# EasyEDA Pro project PRJ_Mainboard V0.1b.epro, schematic Mainboard

## Sheets
1 MCU: Board Name: Mainboard; Create Date: 2025-02-10; Page Name: MCU; Project Name: OrionPnP-Core; Schematic Name: Mainboard; Update Date: 2025-02-10; Company: EasyEDA.com; Drawn: Giovanni C.; Page Size: A3; Version: V0.1b
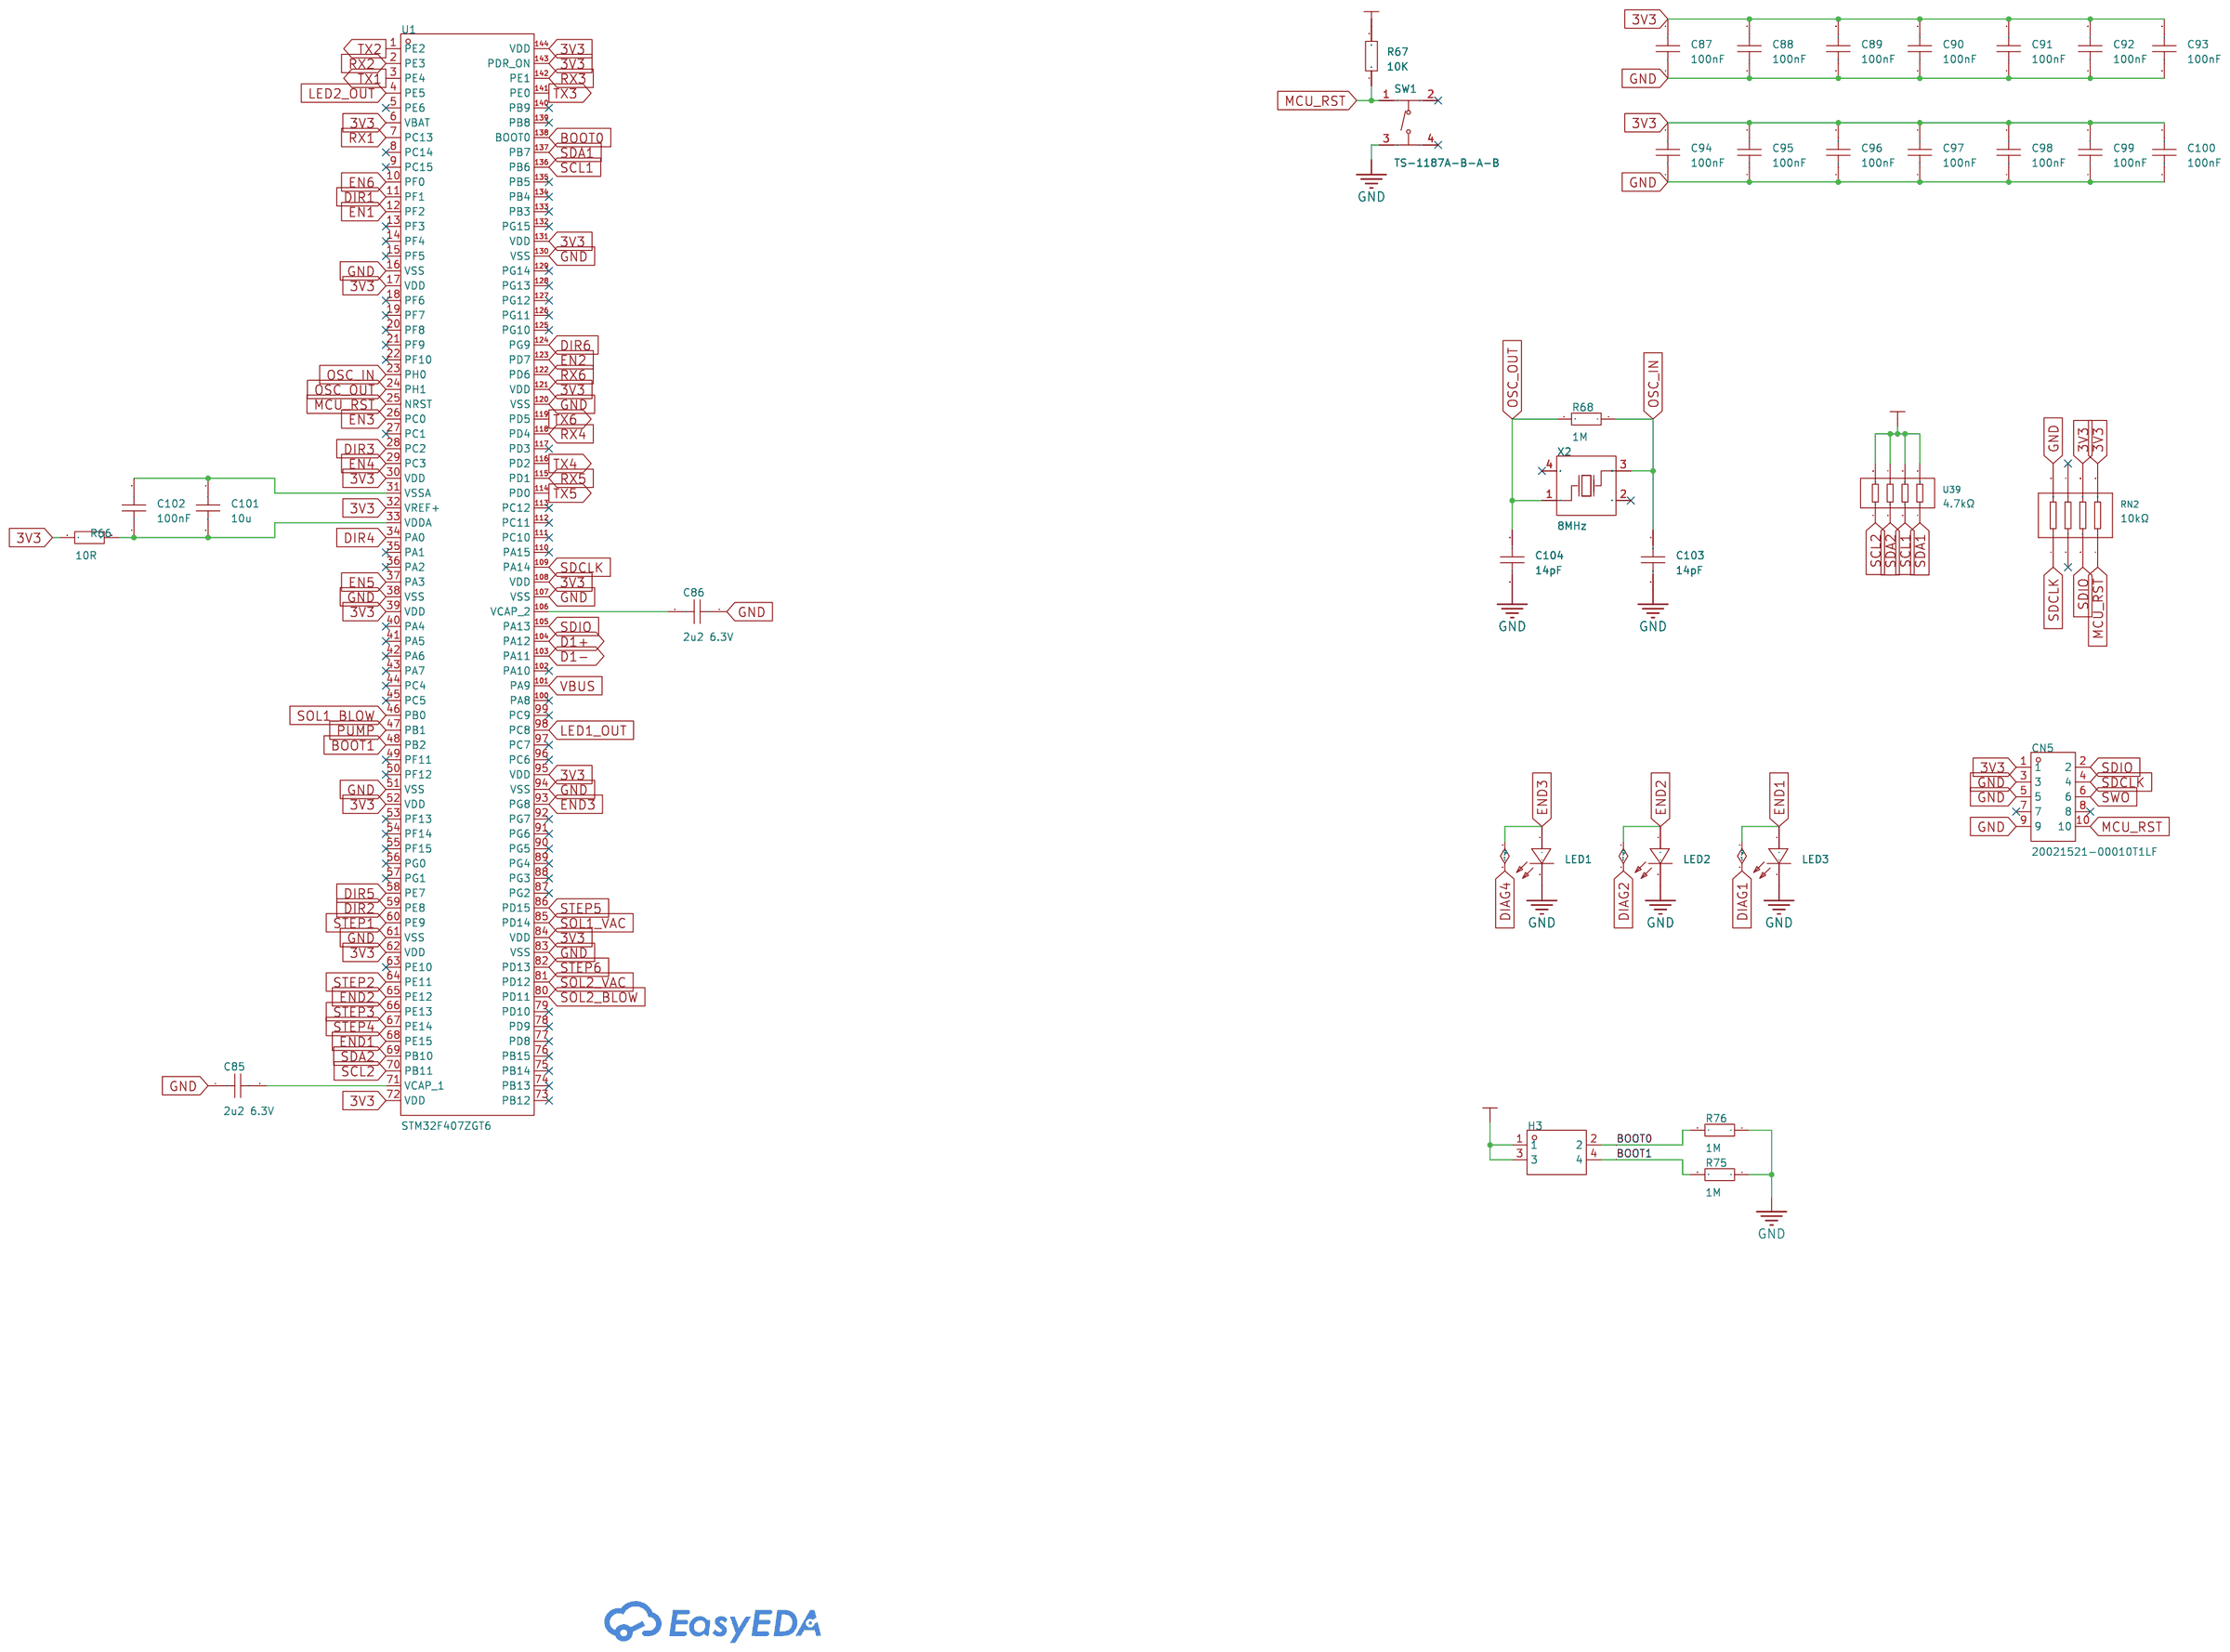
[diagram p0: MCU]
2 PWR: Page Name: PWR; Update Date: 2025-03-29
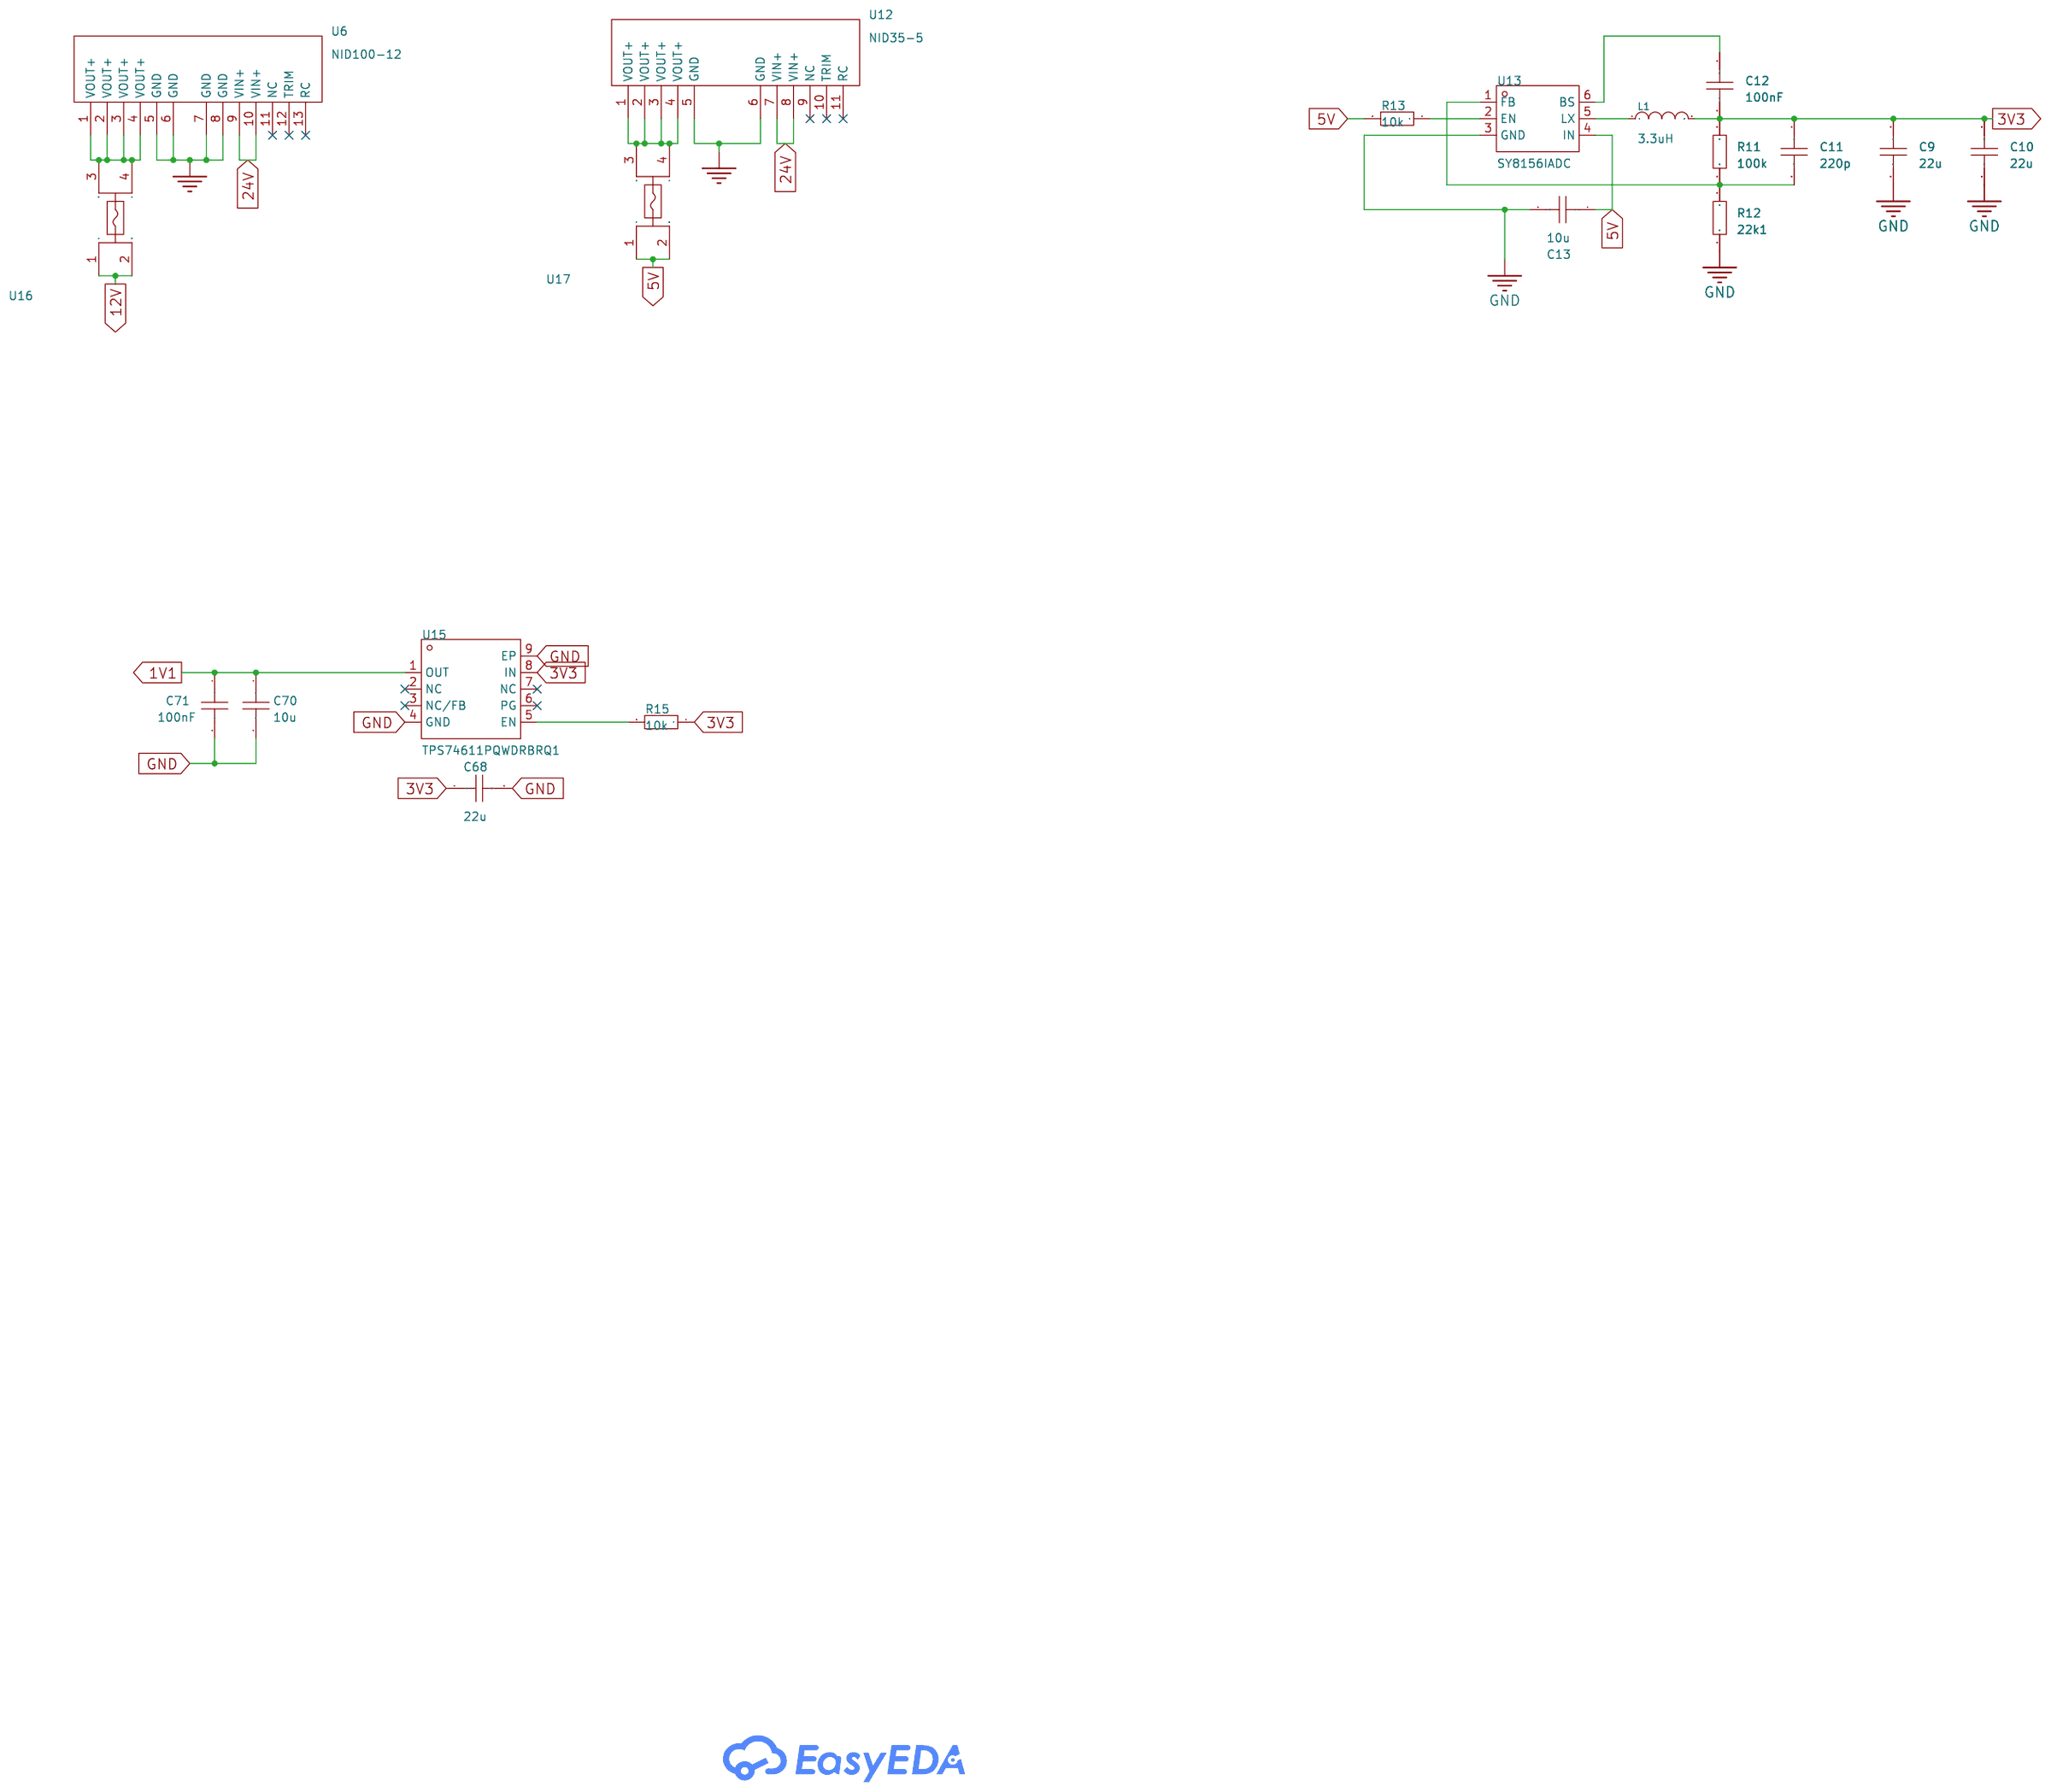
[diagram p1: PWR]
3 STEPPER: Page Name: STEPPER
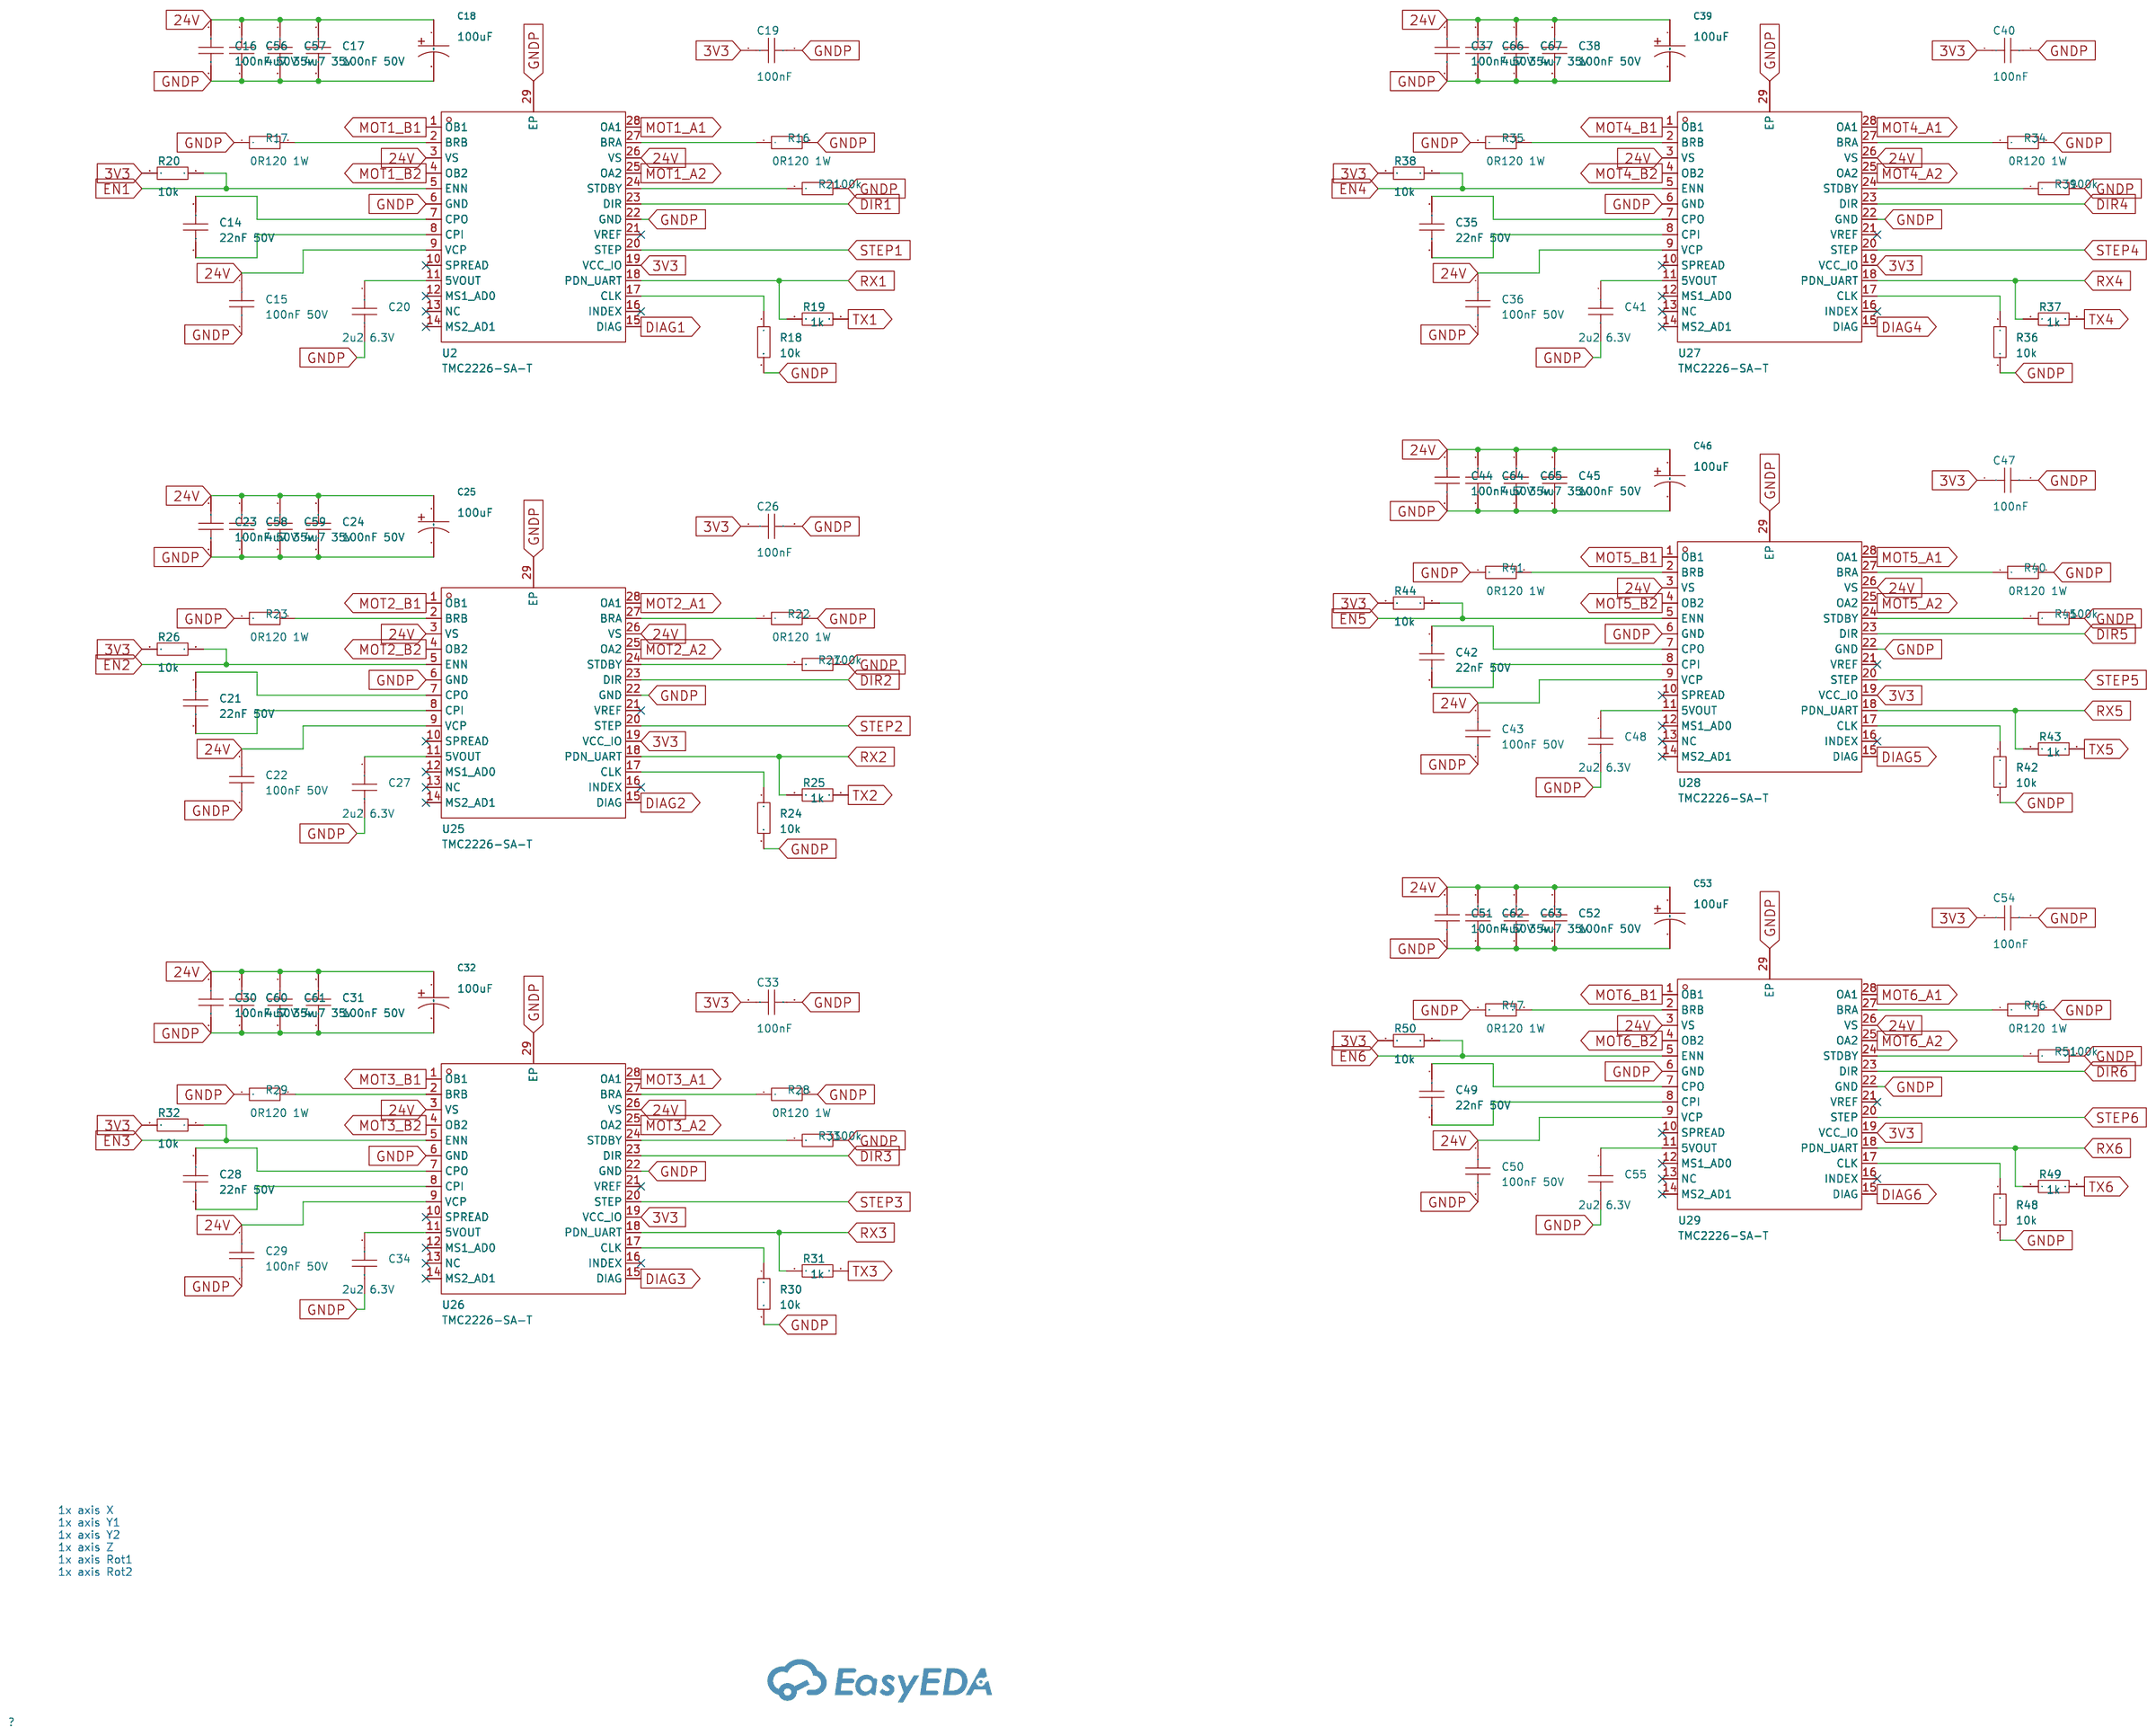
[diagram p2: STEPPER]
4 I/O: Page Name: I/O; Update Date: 2025-02-11
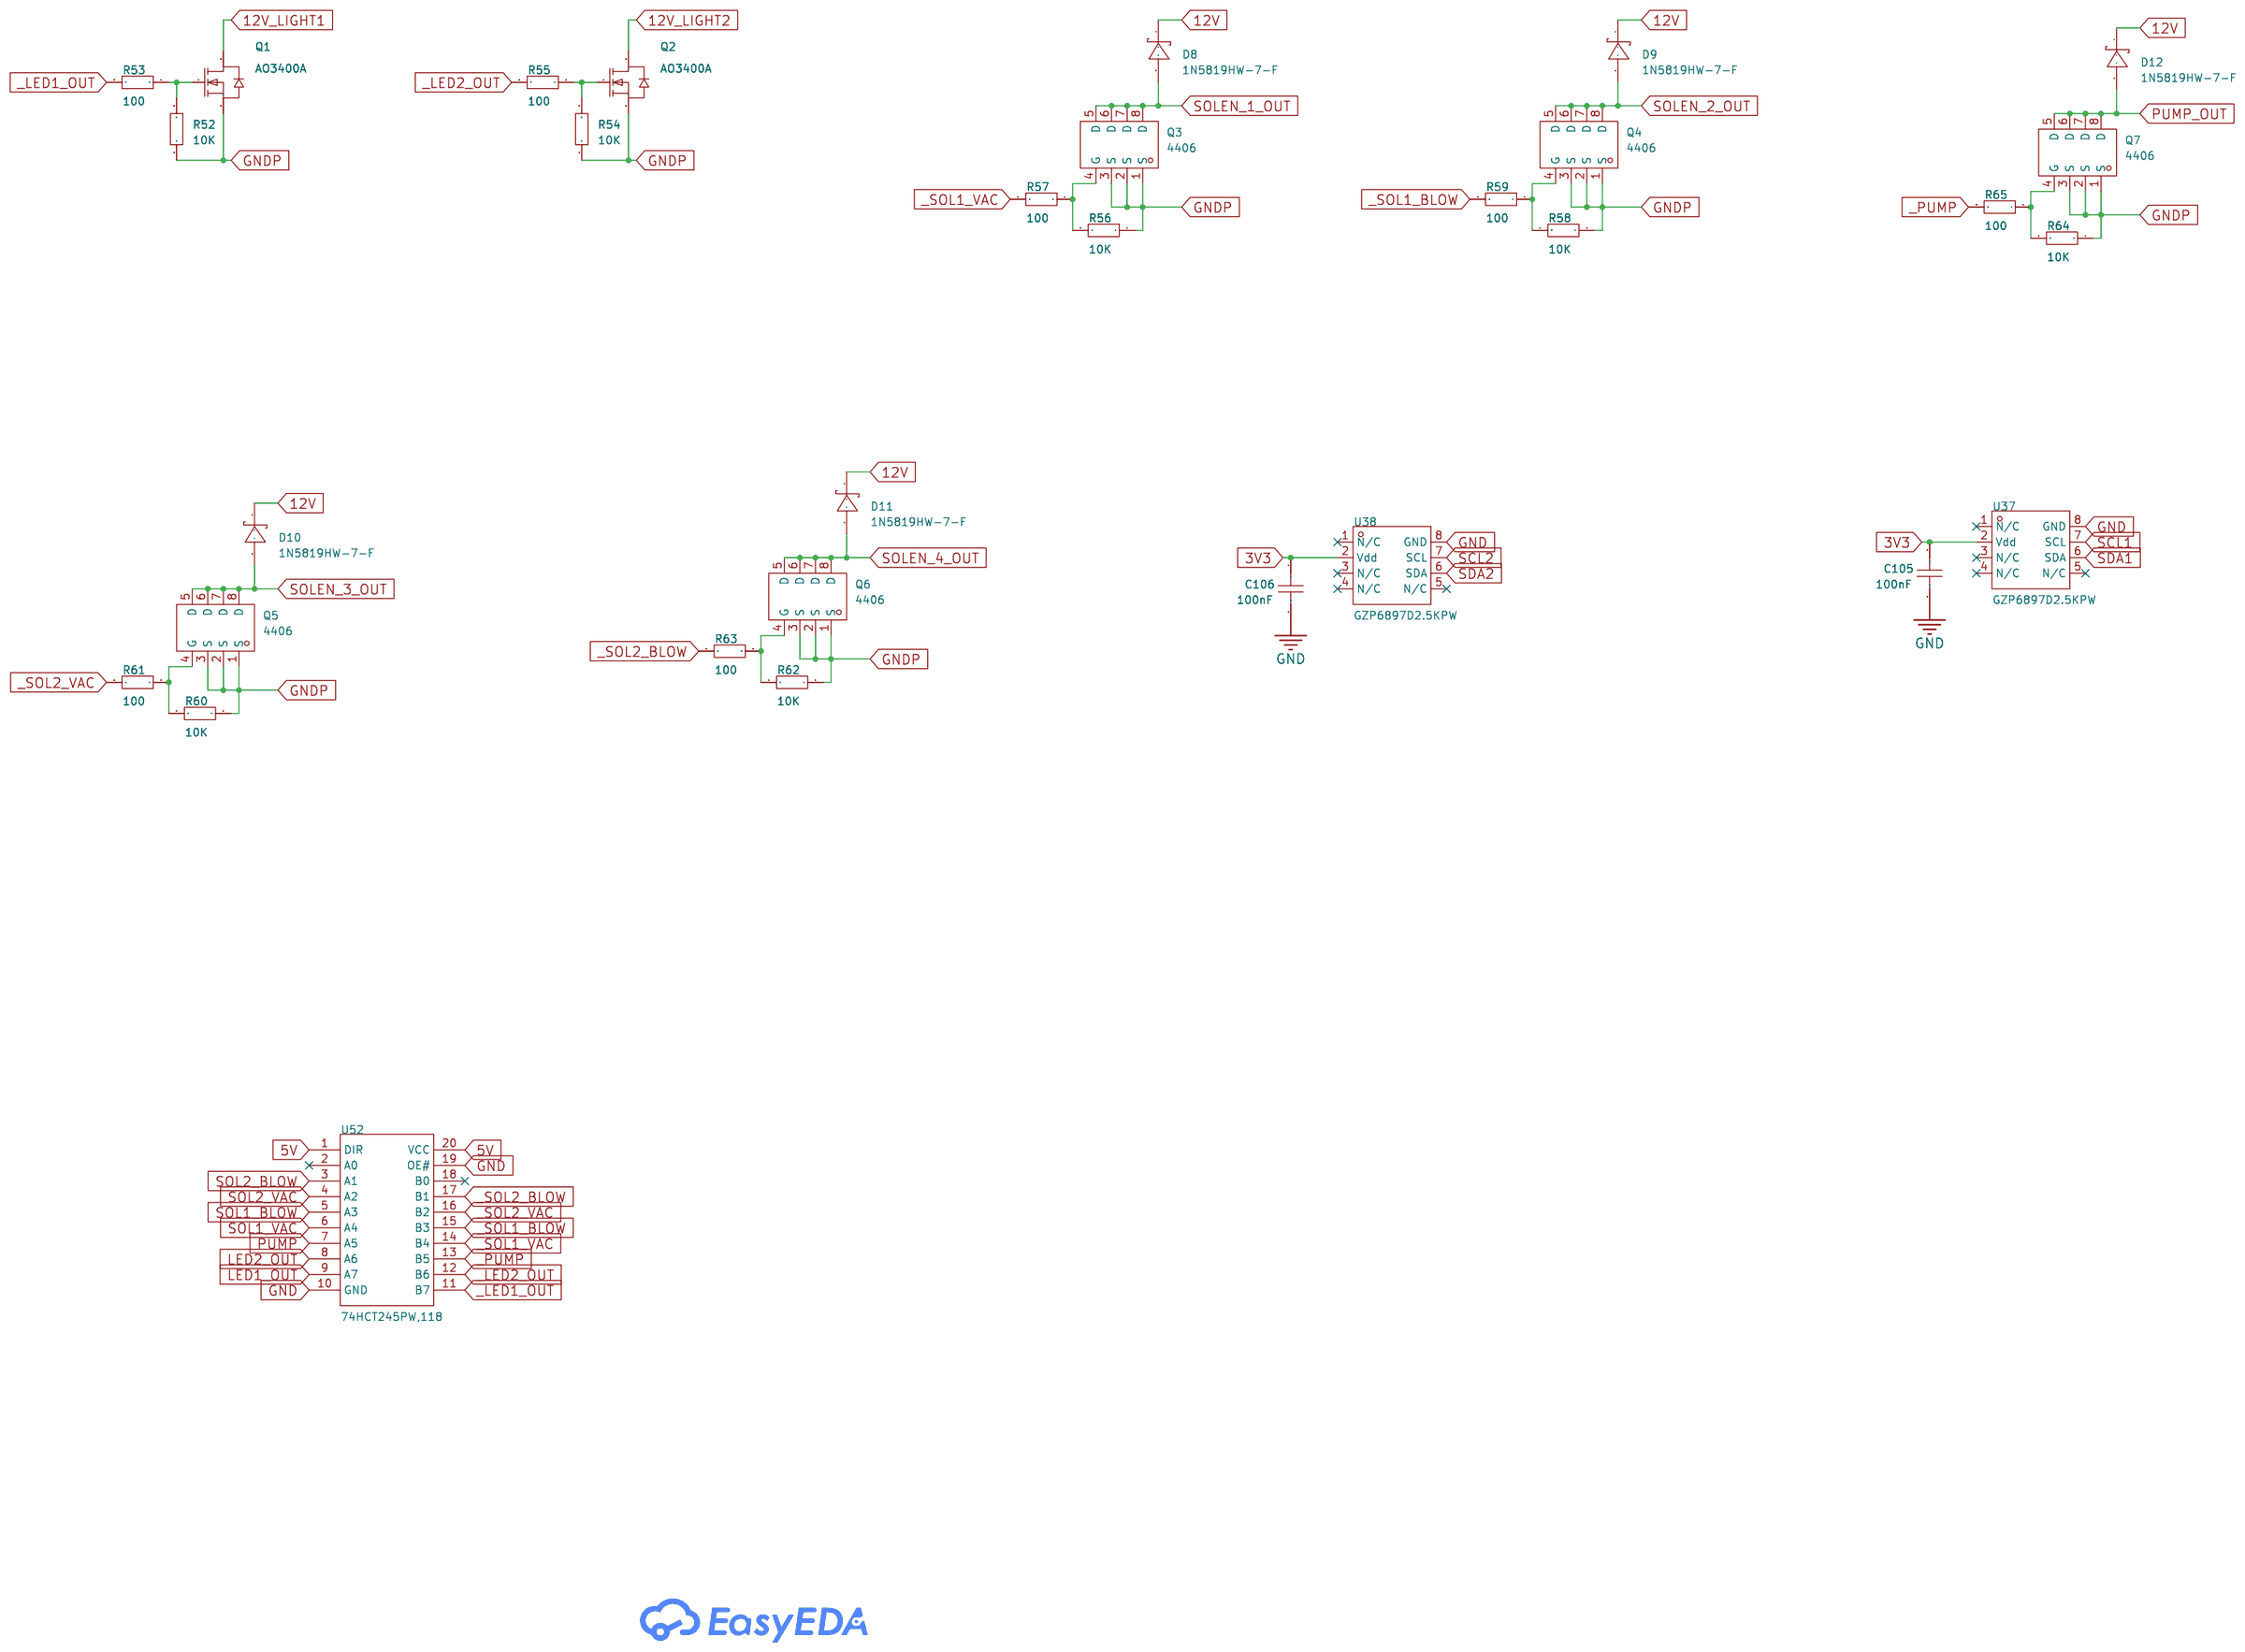
[diagram p3: I/O]
5 CONN: Page Name: CONN; Update Date: 2025-02-28
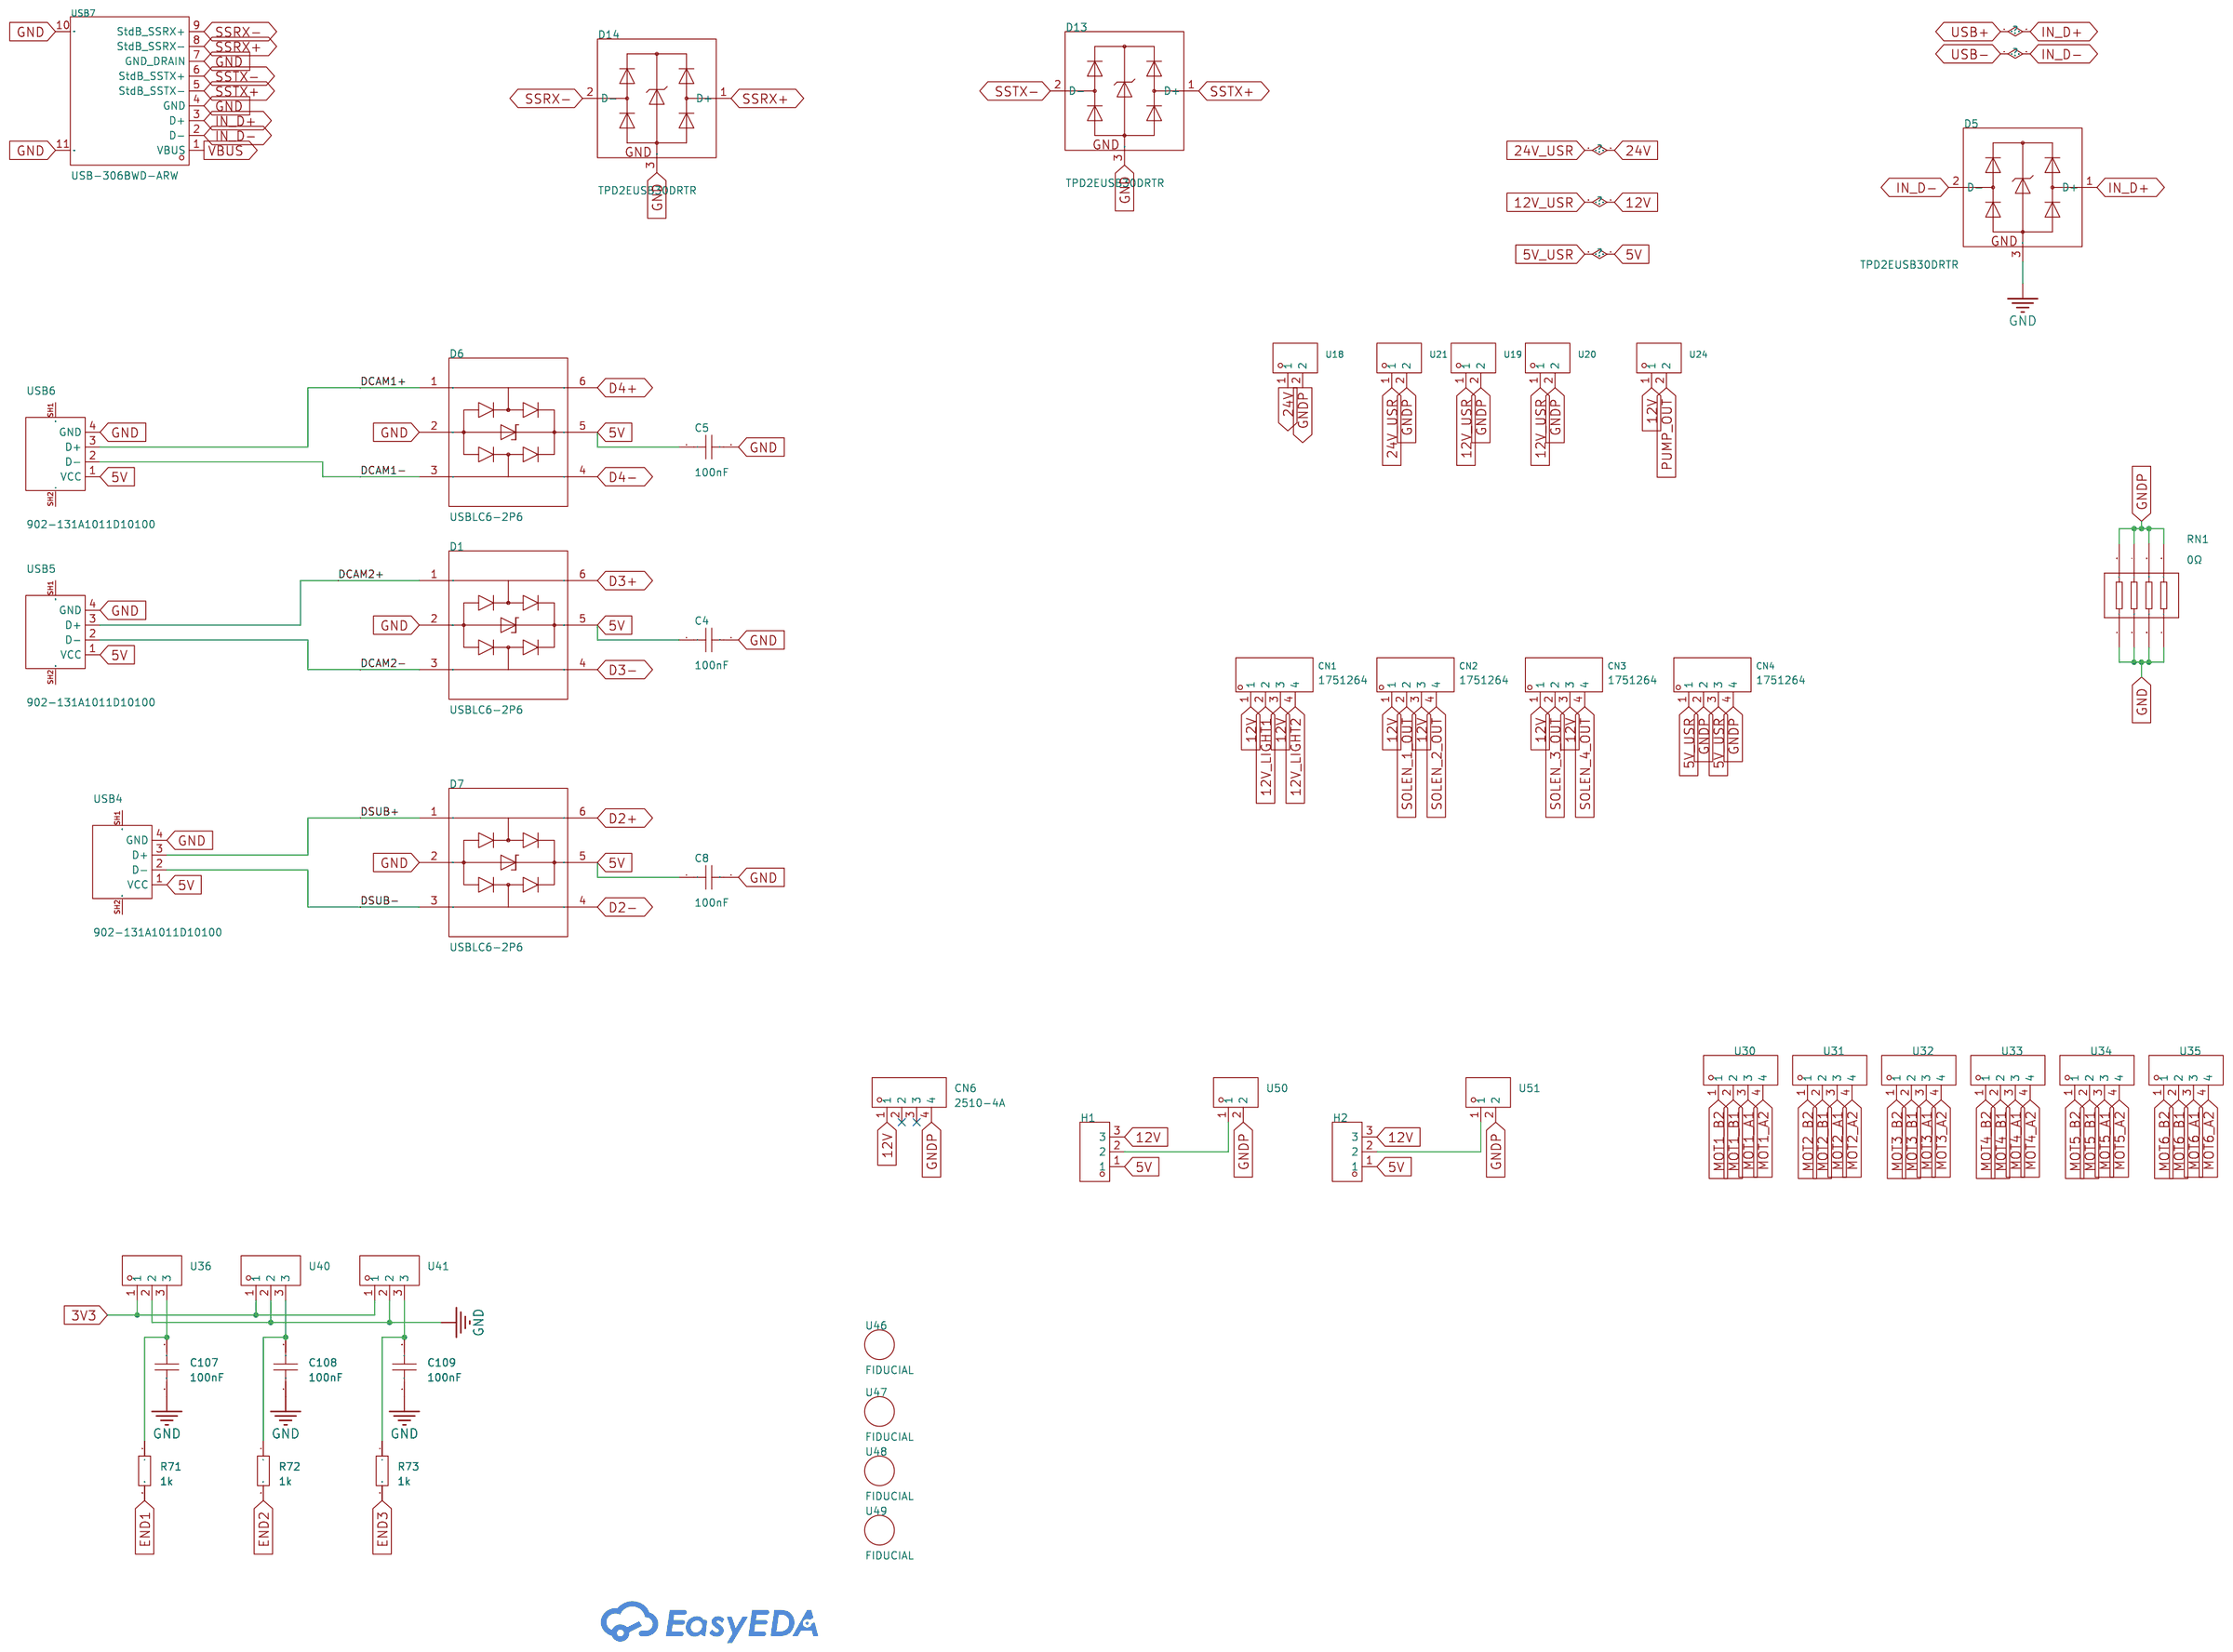
[diagram p4: CONN]
6 USB: Page Name: USB; Company: Orion; Drawn: Cesarotto G.
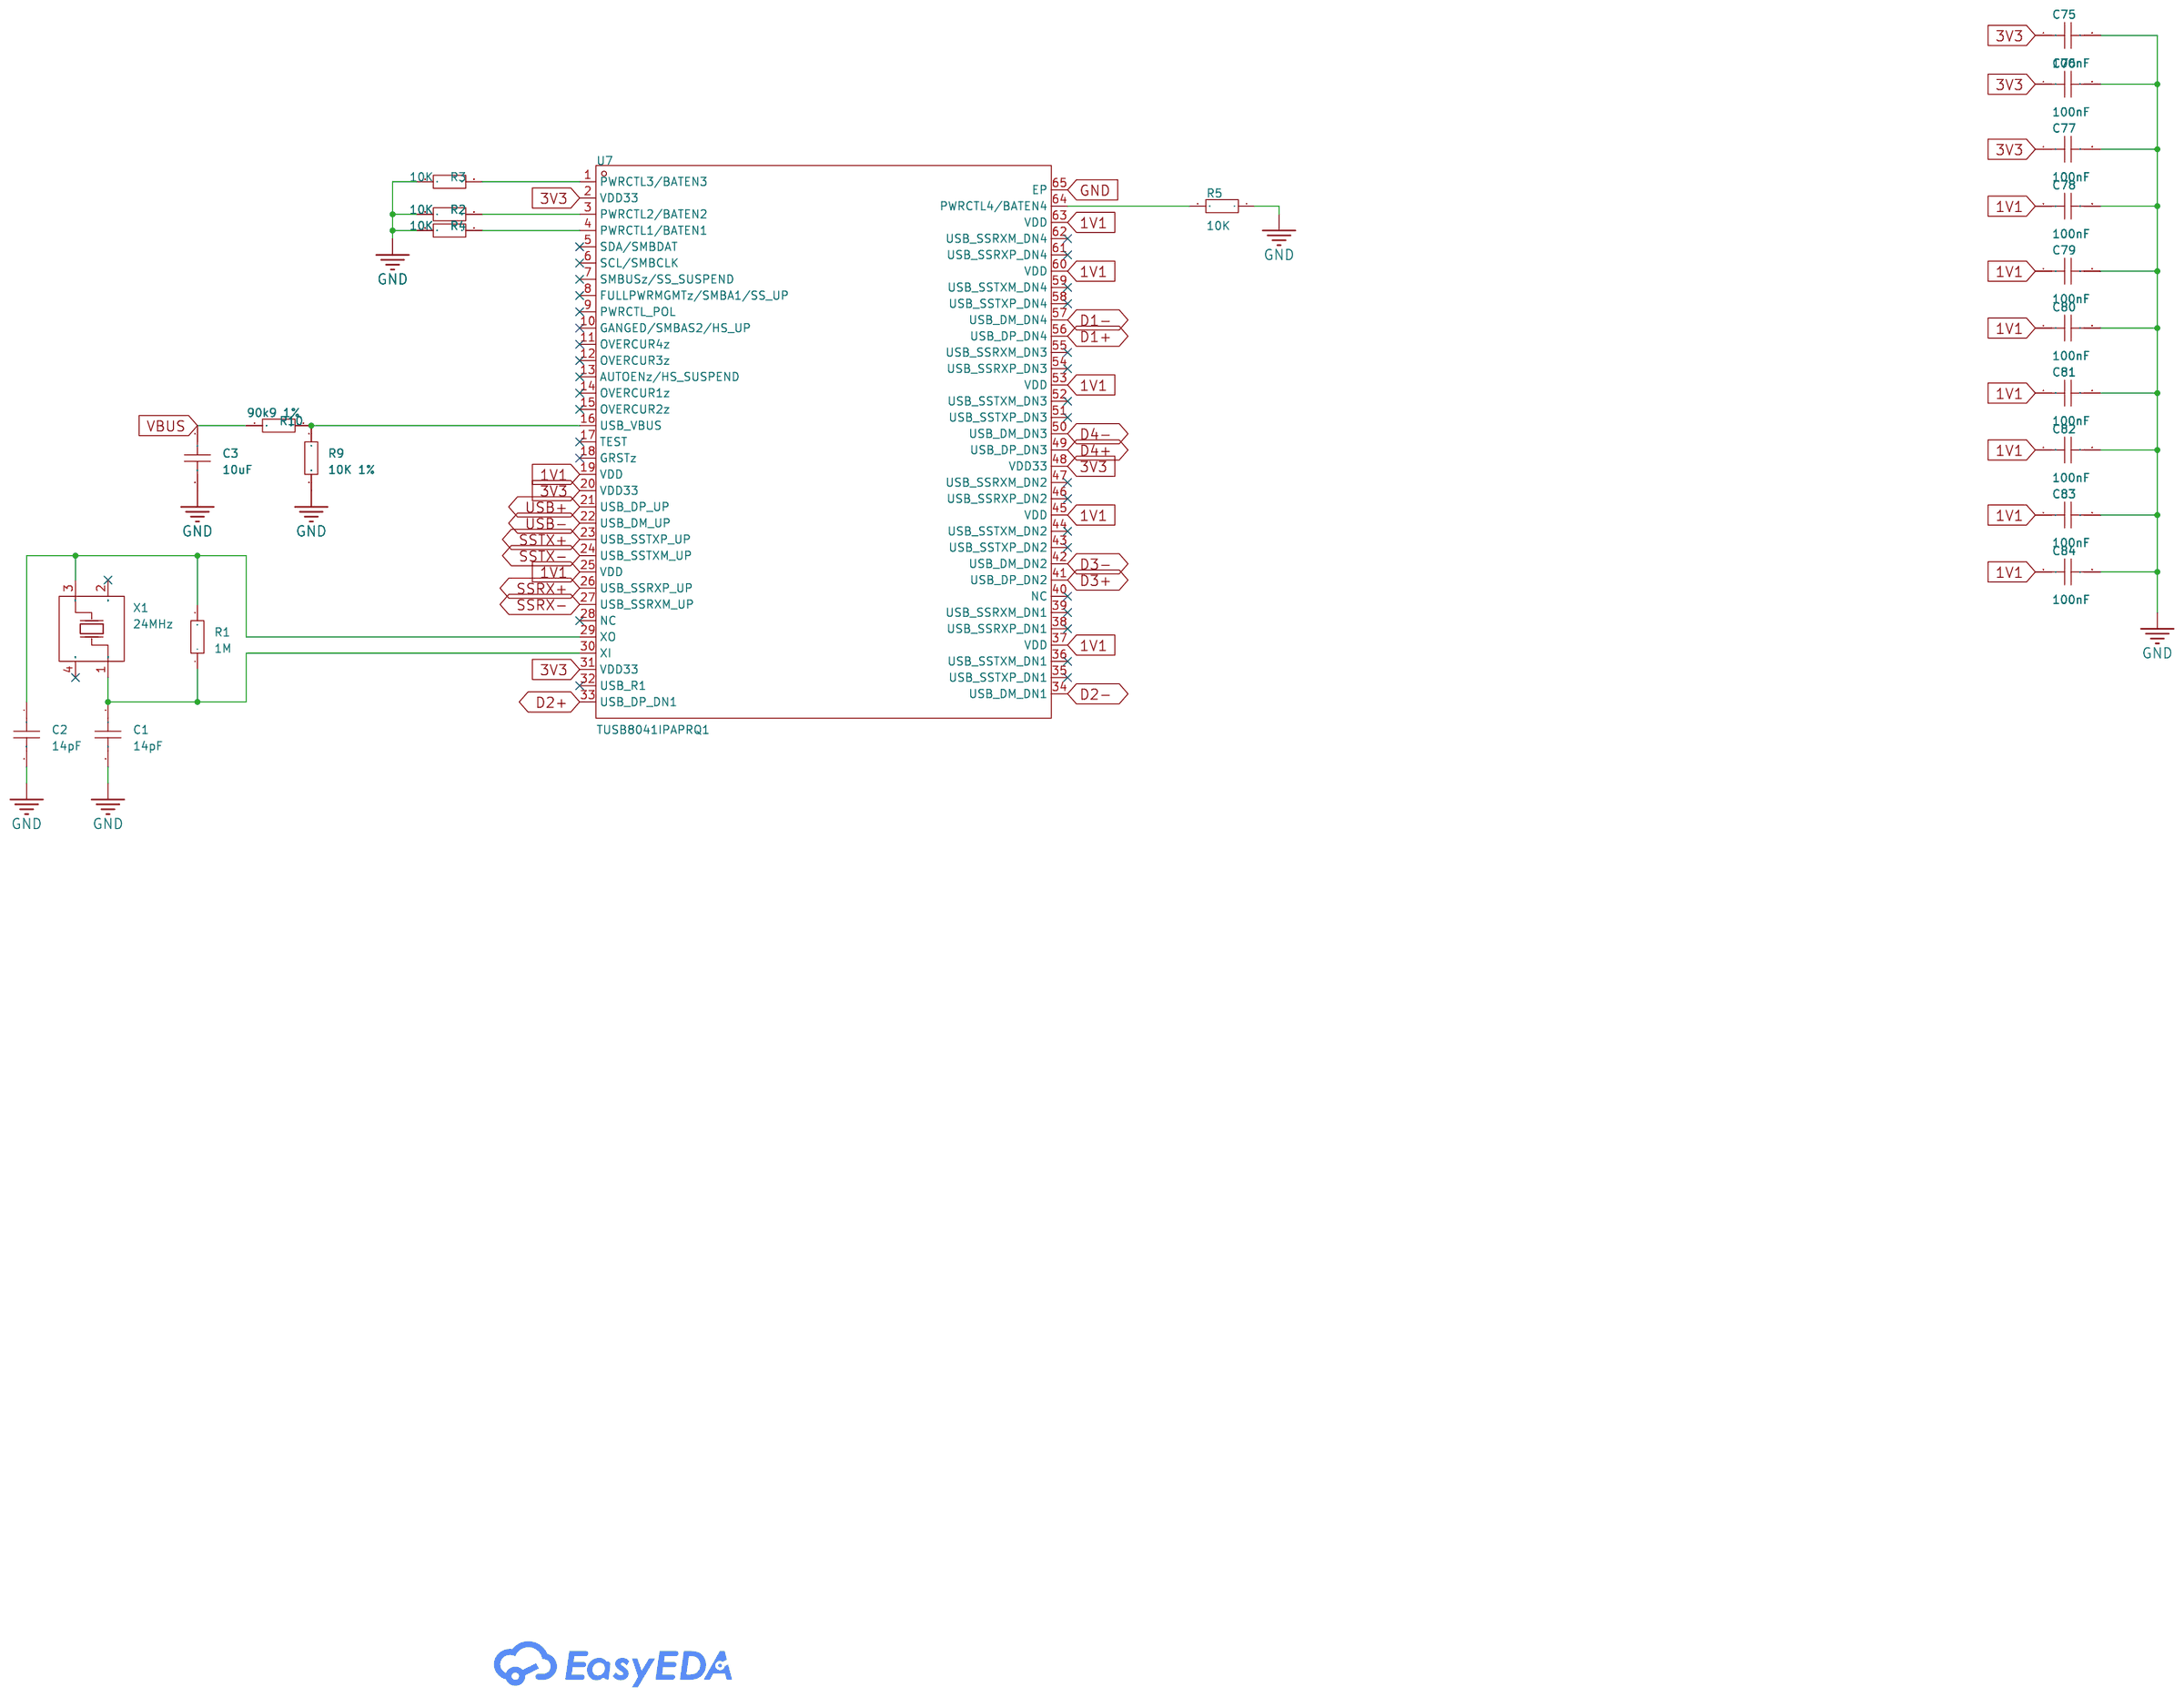
[diagram p5: USB]

## Parts
sheet CONN
C4  100nF  [C0402]
C5  100nF  [C0402]
C8  100nF  [C0402]
C107  100nF  [C0402]
C108  100nF  [C0402]
C109  100nF  [C0402]
CN1  1751264  [CONN-TH_MKDS1-4-3.5]
CN2  1751264  [CONN-TH_MKDS1-4-3.5]
CN3  1751264  [CONN-TH_MKDS1-4-3.5]
CN4  1751264  [CONN-TH_MKDS1-4-3.5]
CN6  2510-4A  [CONN-TH_4P-P2.54_CAX_2510-4A]
D1  USBLC6-2P6  [SOT-666-6_L1.6-W1.2-P0.50-LS1.6-BR]
D5  TPD2EUSB30DRTR  [SOT-9X3-3_L1.0-W0.8-P0.35-LS1.0-BR]
D6  USBLC6-2P6  [SOT-666-6_L1.6-W1.2-P0.50-LS1.6-BR]
D7  USBLC6-2P6  [SOT-666-6_L1.6-W1.2-P0.50-LS1.6-BR]
D13  TPD2EUSB30DRTR  [SOT-9X3-3_L1.0-W0.8-P0.35-LS1.0-BR]
D14  TPD2EUSB30DRTR  [SOT-9X3-3_L1.0-W0.8-P0.35-LS1.0-BR]
H1  -  [HDR-TH_3P-P2.54-V-M]
H2  -  [HDR-TH_3P-P2.54-V-M]
R71  1k  [R0402]
R72  1k  [R0402]
R73  1k  [R0402]
RN1  0Ω  [RES-ARRAY-SMD_0603-8P-L3.2-W1.6-BL]
U18  1714955  [CONN-TH_P6.35_1714955]
U19  1714955  [CONN-TH_P6.35_1714955]
U20  1714955  [CONN-TH_P6.35_1714955]
U21  1714955  [CONN-TH_P6.35_1714955]
U24  1714955  [CONN-TH_P6.35_1714955]
U30  B4B-XH-A-BK(LF)(SN)  [CONN-TH_B4B-XH-A-BK-LF-SN]
U31  B4B-XH-A-BK(LF)(SN)  [CONN-TH_B4B-XH-A-BK-LF-SN]
U32  B4B-XH-A-BK(LF)(SN)  [CONN-TH_B4B-XH-A-BK-LF-SN]
U33  B4B-XH-A-BK(LF)(SN)  [CONN-TH_B4B-XH-A-BK-LF-SN]
U34  B4B-XH-A-BK(LF)(SN)  [CONN-TH_B4B-XH-A-BK-LF-SN]
U35  B4B-XH-A-BK(LF)(SN)  [CONN-TH_B4B-XH-A-BK-LF-SN]
U36  XY-XHB2.54-3A11  [HDR-TH_3P-P2.50-V-F-2]
U40  XY-XHB2.54-3A11  [HDR-TH_3P-P2.50-V-F-2]
U41  XY-XHB2.54-3A11  [HDR-TH_3P-P2.50-V-F-2]
U46  FIDUCIAL  [FIDUCIAL_1MM]
U47  FIDUCIAL  [FIDUCIAL_1MM]
U48  FIDUCIAL  [FIDUCIAL_1MM]
U49  FIDUCIAL  [FIDUCIAL_1MM]
U50  WAFER-PH2.0-2PZZ  [CONN-TH_2P-P2.00_HC-PH-2A-M]
U51  WAFER-PH2.0-2PZZ  [CONN-TH_2P-P2.00_HC-PH-2A-M]
USB4  902-131A1011D10100  [USB-A-TH__USB-AF-90]
USB5  902-131A1011D10100  [USB-A-TH__USB-AF-90]
USB6  902-131A1011D10100  [USB-A-TH__USB-AF-90]
USB7  USB-306BWD-ARW  [USB-B-TH_XUNPU_USB-306BWD-ARW]
sheet I/O
C105  100nF  [C0402]
C106  100nF  [C0402]
D8  1N5819HW-7-F  [SOD-123_L2.7-W1.6-LS3.7-RD]
D9  1N5819HW-7-F  [SOD-123_L2.7-W1.6-LS3.7-RD]
D10  1N5819HW-7-F  [SOD-123_L2.7-W1.6-LS3.7-RD]
D11  1N5819HW-7-F  [SOD-123_L2.7-W1.6-LS3.7-RD]
D12  1N5819HW-7-F  [SOD-123_L2.7-W1.6-LS3.7-RD]
Q1  AO3400A  [SOT-23-3_L2.9-W1.3-P1.90-LS2.4-BR]
Q2  AO3400A  [SOT-23-3_L2.9-W1.3-P1.90-LS2.4-BR]
Q3  4406  [SOP-8_L4.9-W3.9-P1.27-LS6.0-BL]
Q4  4406  [SOP-8_L4.9-W3.9-P1.27-LS6.0-BL]
Q5  4406  [SOP-8_L4.9-W3.9-P1.27-LS6.0-BL]
Q6  4406  [SOP-8_L4.9-W3.9-P1.27-LS6.0-BL]
Q7  4406  [SOP-8_L4.9-W3.9-P1.27-LS6.0-BL]
R52  10K  [R0402]
R53  100  [R0402]
R54  10K  [R0402]
R55  100  [R0402]
R56  10K  [R0402]
R57  100  [R0402]
R58  10K  [R0402]
R59  100  [R0402]
R60  10K  [R0402]
R61  100  [R0402]
R62  10K  [R0402]
R63  100  [R0402]
R64  10K  [R0402]
R65  100  [R0402]
U37  GZP6897D2.5KPW  [SMD-8_L11.0-W7.0-P2.54-LS10.4-BL]
U38  GZP6897D2.5KPW  [SMD-8_L11.0-W7.0-P2.54-LS10.4-BL]
U52  74HCT245PW,118  [TSSOP-20_L6.5-W4.4-P0.65-LS6.4-BL]
sheet MCU
C85  2u2 6.3V  [C0603]
C86  2u2 6.3V  [C0603]
C87  100nF  [C0402]
C88  100nF  [C0402]
C89  100nF  [C0402]
C90  100nF  [C0402]
C91  100nF  [C0402]
C92  100nF  [C0402]
C93  100nF  [C0402]
C94  100nF  [C0402]
C95  100nF  [C0402]
C96  100nF  [C0402]
C97  100nF  [C0402]
C98  100nF  [C0402]
C99  100nF  [C0402]
C100  100nF  [C0402]
C101  10u  [C0603]
C102  100nF  [C0603]
C103  14pF  [C0402]
C104  14pF  [C0402]
CN5  20021521-00010T1LF  [IDC-SMD_10P-P1.27_X1270WVS-2X05B-6TV01]
H3  -  [HDR-TH_4P-P2.54-V-M-R2-C2-S2.54-1]
LED1  NCD0805R1  [LED0805-R-RD]
LED2  NCD0805R1  [LED0805-R-RD]
LED3  NCD0805R1  [LED0805-R-RD]
R66  10R  [R0402]
R67  10K  [R0402]
R68  1M  [R0402]
R75  1M  [R0402]
R76  1M  [R0402]
RN2  10kΩ  [RES-ARRAY-SMD_0603-8P-L3.2-W1.6-BL]
SW1  TS-1187A-B-A-B  [SW-SMD_4P-L5.1-W5.1-P3.70-LS6.5-TL_H1.5]
U1  STM32F407ZGT6  [LQFP-144_L20.0-W20.0-P0.50-LS22.0-BL]
U39  4.7kΩ  [RES-ARRAY-SMD_0603-8P-L3.2-W1.6-BL]
X2  8MHz  [CRYSTAL-SMD_4P-L3.2-W2.5-BL-2]
sheet PWR
C9  22u  [C0603]
C10  22u  [C0603]
C11  220p  [C0603]
C12  100nF  [C0402]
C13  10u  [C0603]
C68  22u  [C0603]
C70  10u  [C0603]
C71  100nF  [C0402]
L1  3.3uH  [IND-SMD_L6.9-W6.9-LS7.0]
R11  100k  [R0402]
R12  22k1  [R0402]
R13  10k  [R0402]
R15  10k  [R0402]
U6  NID100-12  [NID100-v PSU module]  (no BOM)
U12  NID35-5  [NID35-v PSU module]  (no BOM)
U13  SY8156IADC  [TSOT-23-6_L2.9-W1.6-P0.95-LS2.8-BL]
U15  TPS74611PQWDRBRQ1  [SON-8_L3.0-W3.0-P0.65-TL-EP]
U16  -  [XF-508PVS-B-B-R]
U17  -  [XF-508PVS-B-B-R]
sheet STEPPER
C14  22nF 50V  [C0603]
C15  100nF 50V  [C0603]
C16  100nF 50V  [C0603]
C17  100nF 50V  [C0603]
C18  100uF  [CAP-SMD_BD8.0-L8.3-W8.3-FD]
C19  100nF  [C0603]
C20  2u2 6.3V  [C0603]
C21  22nF 50V  [C0603]
C22  100nF 50V  [C0603]
C23  100nF 50V  [C0603]
C24  100nF 50V  [C0603]
C25  100uF  [CAP-SMD_BD8.0-L8.3-W8.3-FD]
C26  100nF  [C0603]
C27  2u2 6.3V  [C0603]
C28  22nF 50V  [C0603]
C29  100nF 50V  [C0603]
C30  100nF 50V  [C0603]
C31  100nF 50V  [C0603]
C32  100uF  [CAP-SMD_BD8.0-L8.3-W8.3-FD]
C33  100nF  [C0603]
C34  2u2 6.3V  [C0603]
C35  22nF 50V  [C0603]
C36  100nF 50V  [C0603]
C37  100nF 50V  [C0603]
C38  100nF 50V  [C0603]
C39  100uF  [CAP-SMD_BD8.0-L8.3-W8.3-FD]
C40  100nF  [C0603]
C41  2u2 6.3V  [C0603]
C42  22nF 50V  [C0603]
C43  100nF 50V  [C0603]
C44  100nF 50V  [C0603]
C45  100nF 50V  [C0603]
C46  100uF  [CAP-SMD_BD8.0-L8.3-W8.3-FD]
C47  100nF  [C0603]
C48  2u2 6.3V  [C0603]
C49  22nF 50V  [C0603]
C50  100nF 50V  [C0603]
C51  100nF 50V  [C0603]
C52  100nF 50V  [C0603]
C53  100uF  [CAP-SMD_BD8.0-L8.3-W8.3-FD]
C54  100nF  [C0603]
C55  2u2 6.3V  [C0603]
C56  4u7 35v  [C0603]
C57  4u7 35v  [C0603]
C58  4u7 35v  [C0603]
C59  4u7 35v  [C0603]
C60  4u7 35v  [C0603]
C61  4u7 35v  [C0603]
C62  4u7 35v  [C0603]
C63  4u7 35v  [C0603]
C64  4u7 35v  [C0603]
C65  4u7 35v  [C0603]
C66  4u7 35v  [C0603]
C67  4u7 35v  [C0603]
R16  0R120 1W  [R1210]
R17  0R120 1W  [R1210]
R18  10k  [R0402]
R19  1k  [R0402]
R20  10k  [R0402]
R21  100k  [R0402]
R22  0R120 1W  [R1210]
R23  0R120 1W  [R1210]
R24  10k  [R0402]
R25  1k  [R0402]
R26  10k  [R0402]
R27  100k  [R0402]
R28  0R120 1W  [R1210]
R29  0R120 1W  [R1210]
R30  10k  [R0402]
R31  1k  [R0402]
R32  10k  [R0402]
R33  100k  [R0402]
R34  0R120 1W  [R1210]
R35  0R120 1W  [R1210]
R36  10k  [R0402]
R37  1k  [R0402]
R38  10k  [R0402]
R39  100k  [R0402]
R40  0R120 1W  [R1210]
R41  0R120 1W  [R1210]
R42  10k  [R0402]
R43  1k  [R0402]
R44  10k  [R0402]
R45  100k  [R0402]
R46  0R120 1W  [R1210]
R47  0R120 1W  [R1210]
R48  10k  [R0402]
R49  1k  [R0402]
R50  10k  [R0402]
R51  100k  [R0402]
U2  TMC2226-SA-T  [HTSSOP-28_L9.8-W4.5-P0.65-LS6.6-BL-EP]
U25  TMC2226-SA-T  [HTSSOP-28_L9.8-W4.5-P0.65-LS6.6-BL-EP]
U26  TMC2226-SA-T  [HTSSOP-28_L9.8-W4.5-P0.65-LS6.6-BL-EP]
U27  TMC2226-SA-T  [HTSSOP-28_L9.8-W4.5-P0.65-LS6.6-BL-EP]
U28  TMC2226-SA-T  [HTSSOP-28_L9.8-W4.5-P0.65-LS6.6-BL-EP]
U29  TMC2226-SA-T  [HTSSOP-28_L9.8-W4.5-P0.65-LS6.6-BL-EP]
sheet USB
C1  14pF  [C0402]
C2  14pF  [C0402]
C3  10uF  [C0603]
C75  100nF  [C0402]
C76  100nF  [C0402]
C77  100nF  [C0402]
C78  100nF  [C0402]
C79  100nF  [C0402]
C80  100nF  [C0402]
C81  100nF  [C0402]
C82  100nF  [C0402]
C83  100nF  [C0402]
C84  100nF  [C0402]
R1  1M  [R0402]
R2  10K  [R0402]
R3  10K  [R0402]
R4  10K  [R0402]
R5  10K  [R0402]
R9  10K 1%  [R0402]
R10  90k9 1%  [R0402]
U7  TUSB8041IPAPRQ1  [TQFP-64_L10.0-W10.0-P0.50-LS12.0-BL-EP]
X1  24MHz  [CRYSTAL-SMD_4P-L3.2-W2.5-BL]

## Library data of the parts
C1 C2 C4 C5 C8 C12 C71 C75-C84 C103-C109 = CAP_0402: Supplier Part: C1525; Supplier Footprint: 0402
CN1-CN4 = 1751264: Structure:1x4P Pitch:3.5mm Color:Green Mounting Style:Straight Current Rating (Max):13.5A Voltage Rating (Max):200V Number of Pins:4P Number of Rows:1 Wire Gauge - AWG:16~30 Wire Gauge - AWG:16~30 Number of PINs Per Row:4 Operating Temperature Range:- Ope; LCSC Part Name: 3.5mm 1x4P 排数:1 每排P数:4 直插; Supplier Part: C99845; Manufacturer: Phoenix Contact(菲尼克斯); Supplier Footprint: 插件,P=3.5mm; JLCPCB Part Class: Extended Part; Datasheet: https://atta.szlcsc.com/upload/public/pdf/source/20170412/1491969267555.pdf; Supplier: LCSC; Structure: 1x4P; Pitch: 3.5mm; Color: Green; Mounting Style: Straight; Current Rating (Max): 13.5A; Voltage Rating (Max): 200V; Number of Pins: 4P; Number of Rows: 1; Wire Gauge - AWG: 16~30; Number of PINs Per Row: 4
CN6 = 2510-4A: Pins Structure:1x4P Pitch:2.54mm Mounting Style:Straight Number of Pins:4P Number of Rows:1 Number of PINs Per Row:4 Current Rating (Max):3A Operating Temperature Range:-25℃~+85℃ Operating Temperature Range:-25℃~+85℃; LCSC Part Name: 1x4P 间距:2.54mm 直插; Supplier Part: C2847671; Manufacturer: CAX(创都); Supplier Footprint: 插件,P=2.54mm; JLCPCB Part Class: Extended Part; Datasheet: https://atta.szlcsc.com/upload/public/pdf/source/20200320/C27543_EB34581EFA64AAC535A39AFFC5EB93C7.pdf; Supplier: LCSC; Pins Structure: 1x4P; Pitch: 2.54mm; Mounting Style: Straight; Number of Pins: 4P; Number of Rows: 1; Number of PINs Per Row: 4; Current Rating (Max): 3A; Operating Temperature Range: -25℃~+85℃
D1 D6 D7 = USBLC6-2P6_C15999: polarity:Unidirectional Reverse Stand-Off Voltage (Vrwm):5.25V Maximum Clamping Voltage:17V Peak Pulse Current (Ipp):5A Breakdown Voltage:6V Number of Lines:Dual channel Type:ESD; LCSC Part Name: 单向ESD; Supplier Part: C15999; Manufacturer: ST(意法半导体); Supplier Footprint: SOT-666-6; JLCPCB Part Class: Extended Part; Datasheet: https://atta.szlcsc.com/upload/public/pdf/source/20140724/1457707160627.pdf; Supplier: LCSC; polarity: Unidirectional; Reverse Stand-Off Voltage (Vrwm): 5.25V; Maximum Clamping Voltage: 17V; Peak Pulse Current (Ipp): 5A; Breakdown Voltage: 6V; Number of Lines: Dual channel; Type: ESD
D5 D13 D14 = TPD2EUSB30DRTR: polarity:Unidirectional Reverse Stand-Off Voltage (Vrwm):5.5V Maximum Clamping Voltage:8V Peak Pulse Current (Ipp):1A Peak Pulse Power Dissipation (Ppp):45W Breakdown Voltage:7V Operating Temperature:-40℃~+85℃@(Ta) Operating Temperature:-40℃~+85℃@(Ta) Typ; LCSC Part Name: 单向ESD; Supplier Part: C97502; Manufacturer: TI(德州仪器); Supplier Footprint: SOT(9x3); JLCPCB Part Class: Extended Part; Datasheet: https://www.ti.com/cn/lit/gpn/tpd2eusb30; Supplier: LCSC; polarity: Unidirectional; Reverse Stand-Off Voltage (Vrwm): 5.5V; Maximum Clamping Voltage: 8V; Peak Pulse Current (Ipp): 1A; Peak Pulse Power Dissipation (Ppp): 45W; Breakdown Voltage: 7V; Operating Temperature: -40℃~+85℃@(Ta); Type: ESD
H1 H2 = HDR-M_2.54_1x3P: Supplier Footprint: Through
R1-R5 R9-R13 R15 R18-R21 R24-R27 R30-R33 R36-R39 R42-R45 R48-R68 R71-R73 R75 R76 = Res_0402: Supplier Footprint: 0402
RN1 = YC164-JR-070RL: Number of Resistors: Resistance: Tolerance:±5% Tolerance:±5% Power(Watts): Temperature Coefficient:±200ppm/℃ Temperature Coefficient:±200ppm/℃ Number of Pins:; LCSC Part Name: 0Ω ±5%; Supplier Part: C327053; Manufacturer: YAGEO(国巨); Supplier Footprint: 0603x4; JLCPCB Part Class: Extended Part; Datasheet: https://atta.szlcsc.com/upload/public/pdf/source/20181031/C327053_83904E7E99C831138D2428A732EF3A25.pdf; Supplier: LCSC; Tolerance: ±5%; Temperature Coefficient: ±200ppm/℃
U18-U21 U24 = 1714955: Structure:1x2P Pitch:6.35mm Color:Green Mounting Style:Straight Current Rating (Max):32A Voltage Rating (Max):500V Number of Pins:2P Number of Rows:1 Wire Gauge - AWG:10~30 Wire Gauge - AWG:10~30 Number of PINs Per Row:2 Operating Temperature Range:- Oper; LCSC Part Name: 6.35mm 1x2P 排数:1 每排P数:2 直插; Supplier Part: C480584; Manufacturer: Phoenix Contact(菲尼克斯); Supplier Footprint: 插件,P=6.35mm; JLCPCB Part Class: Extended Part; Datasheet: https://atta.szlcsc.com/upload/public/pdf/source/20200107/C480584_89D18D704A90DC134E06E80D980B692E.pdf; Supplier: LCSC; Structure: 1x2P; Pitch: 6.35mm; Color: Green; Mounting Style: Straight; Current Rating (Max): 32A; Voltage Rating (Max): 500V; Number of Pins: 2P; Number of Rows: 1; Wire Gauge - AWG: 10~30; Number of PINs Per Row: 2
U30-U35 = B4B-XH-A-BK(LF)(SN): Pins Structure:1x4P Pitch:2.5mm Mounting Style:Direct Insert Reference Series:XH Number of Pins:4P Number of Rows:1 Number of PINs Per Row:4 Row Spacing:- Current Rating (Max):3A Contact Material:Brass Contact Plating:Tin Operating Temperature Range:-25℃~; LCSC Part Name: 1x4P 间距:2.5mm 直插 系列:XH; Supplier Part: C566013; Manufacturer: JST; Supplier Footprint: 插件,P=2.5mm; JLCPCB Part Class: Extended Part; Datasheet: https://atta.szlcsc.com/upload/public/pdf/source/20200721/C566013_FD8E2BAD9B98628ED3256EE9F0485FFD.pdf; Supplier: LCSC; Pins Structure: 1x4P; Pitch: 2.5mm; Mounting Style: Direct Insert; Reference Series: XH; Number of Pins: 4P; Number of Rows: 1; Number of PINs Per Row: 4; Current Rating (Max): 3A; Contact Material: Brass; Contact Plating: Tin; Operating Temperature Range: -25℃~+85℃; Rated Voltage (Max): 250V; Plastic Material: PA66; Flame Retardant Rating: UL94V-0; Supplementary Features: K-leg punch; Colour: Black; Z-Height of the Board: 7mm; X-Length of Bottom Edge on Board (Spacing Line): 12.4mm; Y-Width of Bottom Edge on Board: 5.75mm
U36 U40 U41 = XY-XHB2.54-3A11: Pins Structure:1x3P Pitch:2.54mm Mounting Style:Straight Number of Pins:3P Number of Rows:1 Number of PINs Per Row:3 Row Spacing:2.54mm Current Rating (Max):2A Operating Temperature Range:-25℃~+85℃ Operating Temperature Range:-25℃~+85℃; LCSC Part Name: 1x3P 间距:2.54mm 直插; Supplier Part: C19271387; Manufacturer: XYECONN(辛译); Supplier Footprint: 插件,P=2.54mm; JLCPCB Part Class: Extended Part; Datasheet: https://atta.szlcsc.com/upload/public/pdf/source/20231124/C902967B562345BA8733710E2DCD4DF9.pdf; Supplier: LCSC; Pins Structure: 1x3P; Pitch: 2.54mm; Mounting Style: Straight; Number of Pins: 3P; Number of Rows: 1; Number of PINs Per Row: 3; Row Spacing: 2.54mm; Current Rating (Max): 2A; Operating Temperature Range: -25℃~+85℃
U46-U49 = FIDUCIAL
U50 U51 = WAFER-PH2.0-2PZZ: Pins Structure:1x2P Pitch:2mm Mounting Style:Direct Insert Reference Series:PH Number of Pins:2P Number of Rows:1 Number of PINs Per Row:2 Current Rating (Max):2A Operating Temperature Range:-25℃~+85℃ Operating Temperature Range:-25℃~+85℃; LCSC Part Name: PH 2.0mm 1x2P 直插; Supplier Part: C5359599; Manufacturer: XUNPU(讯普); Supplier Footprint: 插件,P=2mm; JLCPCB Part Class: Extended Part; Datasheet: https://atta.szlcsc.com/upload/public/pdf/source/20241108/09B74E94153224768C62B7F095CB8C18.pdf; Supplier: LCSC; Pins Structure: 1x2P; Pitch: 2mm; Mounting Style: Direct Insert; Reference Series: PH; Number of Pins: 2P; Number of Rows: 1; Number of PINs Per Row: 2; Current Rating (Max): 2A; Operating Temperature Range: -25℃~+85℃
USB4-USB6 = 902-131A1011D10100: Connector Type:Type-A Standard:USB 2.0 Gender:Female Number of Ports:1 Number of Contacts:4P; LCSC Part Name: Type-A 母; Supplier Part: C2345; Manufacturer: 精拓金; Supplier Footprint: 插件; JLCPCB Part Class: Extended Part; Datasheet: https://atta.szlcsc.com/upload/public/pdf/source/20230426/528E2323E34B388E92F74C2C3C70119D.pdf; Supplier: LCSC; Connector Type: Type-A; Standard: USB 2.0; Gender: Female; Number of Ports: 1; Number of Contacts: 4P
USB7 = USB-306BWD-ARW: Connector Type:Type-B Standard:USB 3.0 Gender:Female Number of Ports:1 Number of Contacts:9P Mounting Style:Right-Angle Current Rating - Power (Max):1.8A Contact Material:- Contact Plating:- Operating Temperature Range:-55℃~+85℃ Operating Temperature Rang; LCSC Part Name: Type-B 母 弯插; Supplier Part: C2895032; Manufacturer: XUNPU(讯普); Supplier Footprint: 插件; JLCPCB Part Class: Extended Part; Datasheet: https://atta.szlcsc.com/upload/public/pdf/source/20210908/45E945139DB1878DA9BE0926433239A6.pdf; Supplier: LCSC; Connector Type: Type-B; Standard: USB 3.0; Gender: Female; Number of Ports: 1; Number of Contacts: 9P; Mounting Style: Right-Angle; Current Rating - Power (Max): 1.8A; Operating Temperature Range: -55℃~+85℃; Soldering Temperature(Max): 260℃
D8-D12 = 1N5819HW-7-F: Forward Voltage (Vf@If):450mV@1A Reverse Voltage (Vr):40V Rectified Current:1A Reverse Leakage Current (Ir):1mA@40V; LCSC Part Name: 电压:40V 电流:1A; Supplier Part: C82544; Manufacturer: DIODES(美台); Supplier Footprint: SOD-123; JLCPCB Part Class: Extended Part; Datasheet: https://atta.szlcsc.com/upload/public/pdf/source/20161024/1477288459223.pdf; Supplier: LCSC; Forward Voltage (Vf@If): 450mV@1A; Reverse Voltage (Vr): 40V; Rectified Current: 1A; Reverse Leakage Current (Ir): 1mA@40V
Q1 Q2 = AO3400A_C347475: Type:1 N-Channel Drain Source Voltage (Vdss): Continuous Drain Current (Id): Drain Source On Resistance (RDS(on)@Vgs,Id):28mΩ@10V,5.8A Power Dissipation (Pd): Gate Threshold Voltage (Vgs(th)@Id):1.4V@250uA Total Gate Charge (Qg@Vgs):12nC@10V Input Capacit; LCSC Part Name: 1个N沟道 耐压:30V 电流:5.8A; Supplier Part: C347475; Manufacturer: UMW(友台半导体); Supplier Footprint: SOT-23; JLCPCB Part Class: Extended Part; Datasheet: https://atta.szlcsc.com/upload/public/pdf/source/20231109/50AB4FB4D66E55864F9B8D027B723C9A.pdf; Supplier: LCSC; Type: 1 N-Channel; Drain Source On Resistance (RDS(on)@Vgs,Id): 28mΩ@10V,5.8A; Gate Threshold Voltage (Vgs(th)@Id): 1.4V@250uA; Total Gate Charge (Qg@Vgs): 12nC@10V; Input Capacitance (Ciss@Vds): 1050pF@24V; Reverse Transfer Capacitance (Crss@Vds): 77pF@15V; Operating Temperature: -55℃~+150℃
Q3-Q7 = 4406: Type:1 N-channel Drain Source Voltage (Vdss): Continuous Drain Current (Id): Drain Source On Resistance (RDS(on)@Vgs,Id):8.5mΩ Power Dissipation (Pd): Gate Threshold Voltage (Vgs(th)@Id):1.5V@250uA Total Gate Charge (Qg@Vgs):19nC@10V Input Capacitance (Ci; LCSC Part Name: 1个N沟道 耐压:30V 电流:13A; Supplier Part: C7431453; Manufacturer: HL(富海微); Supplier Footprint: SOP-8; JLCPCB Part Class: Extended Part; Datasheet: https://atta.szlcsc.com/upload/public/pdf/source/20240110/3E80989B7547D5568B32E6AA17AB1C12.pdf; Supplier: LCSC; Type: 1 N-channel; Drain Source On Resistance (RDS(on)@Vgs,Id): 8.5mΩ; Gate Threshold Voltage (Vgs(th)@Id): 1.5V@250uA; Total Gate Charge (Qg@Vgs): 19nC@10V; Input Capacitance (Ciss@Vds): 1011pF@15V; Reverse Transfer Capacitance (Crss@Vds): 119pF@15V; Operating Temperature: -55℃~+150℃
U37 U38 = GZP6897D2.5KPW: Pressure range:-2.5Kpa~2.5Kpa Pressure range:-2.5Kpa~2.5Kpa The Power Supply Voltage:3.3V The Power Supply Voltage:3.3V Standby Current:100nA The interface type:I2C Operating Temperature:-30℃~+85℃ Operating Temperature:-30℃~+85℃; LCSC Part Name: 压力传感器GZP6897D2.5KPW; Supplier Part: C3038057; Manufacturer: Sencoch(芯感智); Supplier Footprint: SOP-8; JLCPCB Part Class: Extended Part; Datasheet: https://atta.szlcsc.com/upload/public/pdf/source/20230411/4953FFF745F40DA6236914C25B23D6FE.pdf; Supplier: LCSC; Pressure range: -2.5Kpa~2.5Kpa; The Power Supply Voltage: 3.3V; Standby Current: 100nA; The interface type: I2C; Operating Temperature: -30℃~+85℃
U52 = 74HCT245PW,118_C5980: output type:Tri-State Supply Voltage:4.5V~5.5V Supply Voltage:4.5V~5.5V Number of Elements:1 Number of Bits per Element:8 Sink Current:6mA Source Current:6mA Logic Family:74HCT Operating Temperature:-40℃~+125℃ Operating Temperature:-40℃~+125℃; Supplier Part: C5980; Manufacturer: Nexperia(安世); Supplier Footprint: TSSOP-20; JLCPCB Part Class: Extended Part; Datasheet: https://atta.szlcsc.com/upload/public/pdf/source/20240724/EDC8C45902BA97AEC59E8811E3964917.pdf; Supplier: LCSC; output type: Tri-State; Supply Voltage: 4.5V~5.5V; Number of Elements: 1; Number of Bits per Element: 8; Sink Current: 6mA; Source Current: 6mA; Logic Family: 74HCT; Operating Temperature: -40℃~+125℃
C3 C9-C11 C13-C17 C19-C24 C26-C31 C33-C38 C40-C45 C47-C52 C54-C68 C70 C85 C86 C101 C102 = CAP_0603: Supplier Footprint: 0603
C87-C100 = CL05B104KO5NNNC: Capacitance: Tolerance:±10% Tolerance:±10% Voltage Rated: Temperature Coefficient:; LCSC Part Name: 100nF ±10% 16V; Supplier Part: C1525; Manufacturer: SAMSUNG(三星); Supplier Footprint: 0402; JLCPCB Part Class: Basic Part; Datasheet: https://atta.szlcsc.com/upload/public/pdf/source/20160218/1457707763339.pdf; Supplier: LCSC; Tolerance: ±10%
CN5 = 20021521-00010T1LF: Number of Pins:10P Pitch:1.27mm Mounting Style:Standing paste Number of Rows:2 Current Rating (Max):- Operating Temperature Range:- Operating Temperature Range:-; LCSC Part Name: 间距:1.27mm PIN:10P 公 立贴; Supplier Part: C2972785; Manufacturer: Amphenol; Supplier Footprint: SMD,P=1.27mm; JLCPCB Part Class: Extended Part; Datasheet: https://atta.szlcsc.com/upload/public/pdf/source/20220418/3720F6CE576EEF3F058123D41D79595E.pdf; Supplier: LCSC; Number of Pins: 10P; Pitch: 1.27mm; Mounting Style: Standing paste; Number of Rows: 2
H3 = HDR-M_2.54_2x2: Supplier Footprint: Through
LED1-LED3 = NCD0805R1_C84256: Lamp Holder Type:- Emitted Color:Red Forward Voltage (VF):1.6V~2.6V Forward Voltage (VF):1.6V~2.6V Power Dissipation:65mW Forward Current:20mA Dominant Wavelength:615nm~630nm Dominant Wavelength:615nm~630nm Peak Wavelength:- Diode Configuration:独立二极管 Lens; Supplier Part: C84256; Manufacturer: 国星光电; Supplier Footprint: 0805; JLCPCB Part Class: Basic Part; Datasheet: https://atta.szlcsc.com/upload/public/pdf/source/20200820/C84256_F0A75A43B3EAD75808600A0514C76B99.pdf; Supplier: LCSC; Emitted Color: Red; Forward Voltage (VF): 1.6V~2.6V; Power Dissipation: 65mW; Forward Current: 20mA; Dominant Wavelength: 615nm~630nm; Diode Configuration: 独立二极管; Lens Color: 无色透明透镜; Luminous Intensity: 67mcd~195mcd; Viewing Angle: 130°; Operating Temperature: -30℃~+85℃
RN2 = 4D03WGJ0103T5E: Number of Resistors: Resistance:10kΩ Tolerance:±5% Tolerance:±5% Power(Watts): Temperature Coefficient:±200ppm/℃ Temperature Coefficient:±200ppm/℃ Number of Pins:; LCSC Part Name: 10kΩ ±5%; Supplier Part: C29718; Manufacturer: UNI-ROYAL(厚声); Supplier Footprint: 0603x4; JLCPCB Part Class: Basic Part; Datasheet: https://atta.szlcsc.com/upload/public/pdf/source/20191224/C474318_2527498AE30E813171187CCD28401A71.pdf; Supplier: LCSC; Tolerance: ±5%; Temperature Coefficient: ±200ppm/℃
SW1 = TS-1187A-B-A-B: Circuit:SPST Actuator Style:Round Button Operating Force:160gf Mounting Style:Brick nogging Switch Length:5.1mm Switch Width:5.1mm Switch Height:1.5mm Strike Gundam:不带 Contact Current:50mA Voltage Rating (DC):12V Insulation Resistance:- Actuator/Cap Color; LCSC Part Name: 5.1*5.1*1.5mm 立贴 轻触开关; Supplier Part: C318884; Manufacturer: XKB Connectivity(中国星坤); Supplier Footprint: SMD; JLCPCB Part Class: Basic Part; Datasheet: https://atta.szlcsc.com/upload/public/pdf/source/20200227/C318890_053E50208A88A7BA1965D8746000774E.pdf; Supplier: LCSC; Circuit: SPST; Actuator Style: Round Button; Operating Force: 160gf; Mounting Style: Brick nogging; Switch Length: 5.1mm; Switch Width: 5.1mm; Switch Height: 1.5mm; Strike Gundam: 不带; Contact Current: 50mA; Voltage Rating (DC): 12V; Actuator/Cap Color: 金色; With Lamp: No; Mechanical Life: 10万次; Operating Temperature: -30℃~+85℃
U1 = STM32F407ZGT6: CPU Core:ARM-M4 CPU Maximum Speed:168MHz Program Storage Size:1MB Program Memory Type:FLASH Number of I/O:114 ADC (Bit):12bit DAC (Bit):12bit Low Voltage Detection Threshold:1.8V~3.6V Low Voltage Detection Threshold:1.8V~3.6V Application Area:-; LCSC Part Name: 带DSP和FPU的高性能基础系列ARM Cortex-M4 MCU，具有1 MB Flash、168 MHz CPU、ART加速器、以太网和FSMC; Supplier Part: C19156; Manufacturer: ST(意法半导体); Supplier Footprint: LQFP-144(20x20); JLCPCB Part Class: Extended Part; Datasheet: https://atta.szlcsc.com/upload/public/pdf/source/20140801/1457707197138.pdf; Supplier: LCSC; CPU Core: ARM-M4; CPU Maximum Speed: 168MHz; Program Storage Size: 1MB; Program Memory Type: FLASH; Number of I/O: 114; ADC (Bit): 12bit; DAC (Bit): 12bit; Low Voltage Detection Threshold: 1.8V~3.6V
U39 = EXBV8V472JV: Number of Resistors: Resistance:4.7kΩ Tolerance:±5% Tolerance:±5% Power(Watts): Temperature Coefficient:±200ppm/℃ Temperature Coefficient:±200ppm/℃ Number of Pins:; LCSC Part Name: 4.7kΩ ±5%; Supplier Part: C713475; Manufacturer: PANASONIC(松下); Supplier Footprint: 0603x4; JLCPCB Part Class: Extended Part; Datasheet: https://atta.szlcsc.com/upload/public/pdf/source/20200731/C713475_AD0154592A763392467525F65B50BC95.pdf; Supplier: LCSC; Tolerance: ±5%; Temperature Coefficient: ±200ppm/℃
X2 = TAXM8M4RFDCET2T: Crystal Type:Surface Mount Crystal Frequency: Normal temperature Frequency Tolerance:±20ppm Normal temperature Frequency Tolerance:±20ppm Load Capacitor: Frequency Stability(Full temperature range):±20ppm Frequency Stability(Full temperature range):±20ppm; LCSC Part Name: 8MHz ±20ppm 12pF; Supplier Part: C403948; Manufacturer: YJX(雅晶鑫); Supplier Footprint: SMD3225-4P; JLCPCB Part Class: Extended Part; Datasheet: https://atta.szlcsc.com/upload/public/pdf/source/20190712/C403948_DCE244DEF035C9ADCC7C08191B17B6F0.pdf; Supplier: LCSC; Crystal Type: Surface Mount Crystal; Normal temperature Frequency Tolerance: ±20ppm; Frequency Stability(Full temperature range): ±20ppm; Equivalent Series Resistance (ESR): 250Ω
L1 = FHC7050-3R3M: Inductance: Tolerance:±20% Tolerance:±20% Rated Current:- Saturation Current (Isat): DC Resistance (DCR): Q @ Freq:- Frequency - Self Resonant:- Ratings:; LCSC Part Name: 3.3uH ±20% 8A; Supplier Part: C2761959; Manufacturer: KOHERelec(科或); Supplier Footprint: SMD,6.7x7mm; JLCPCB Part Class: Extended Part; Datasheet: https://atta.szlcsc.com/upload/public/pdf/source/20210423/C2761955_AD28FBB4811412F6B477F7ADBC6B6351.pdf; Supplier: LCSC; Tolerance: ±20%
U6 = NID100-12: Manufacturer: MeanWell; URL: https://www.meanwell-web.com/en-gb/dc-dc-non-isolation-open-frame-pcb-mount-converter-nid100--12?returnurl=%2fen-gb%2fsearch%3fq%3dnid100-12%23nid100-12
U12 = NID35-5: Manufacturer: MeanWell; URL: https://www.meanwell-web.com/en-gb/dc-dc-non-isolation-open-frame-pcb-mount-converter-nid35--5?returnurl=%2fen-gb%2fsearch%3fq%3dnid35-%23nid35-5
U13 = SY8156IADC: Supplier Part: C9900034591; Supplier Footprint: TSOT23-6; Supplier: LCSC
U15 = TPS74611PQWDRBRQ1: Output Type:Fixed Maximum Input Voltage:6V Output Voltage:1.1V Output Voltage:1.1V Output Current:1A Power Supply Rejection Ratio (PSRR):- Dropout Voltage:790mV@(1A) standby current:36uA Feature:Overcurrent Protection；Overheat protection Operating Tempera; LCSC Part Name: 具有电源正常指示功能的汽车类、1A、低 IQ、高 PSRR、低压降 (LDO) 稳压器; Supplier Part: C3744086; Manufacturer: TI(德州仪器); Supplier Footprint: SON-8(3x3); JLCPCB Part Class: Extended Part; Datasheet: https://www.ti.com/cn/lit/gpn/tps746-q1; Supplier: LCSC; Output Type: Fixed; Maximum Input Voltage: 6V; Output Voltage: 1.1V; Output Current: 1A; Dropout Voltage: 790mV@(1A); standby current: 36uA; Feature: Overcurrent Protection；Overheat protection; Operating Temperature: -40℃~+125℃@(Ta); Output Polarity: Positive electrode; Number of Outputs: 1
U16 U17 = Fuse holder XF-508PVS: LCSC Part Name: C42419935
C18 C25 C32 C39 C46 C53 = EEEFP1H101AP: Capacitance: Tolerance:±20% Tolerance:±20% Rated Voltage: Ripple Current:670mA@100kHz Equivalent Series Resistance(ESR):180mΩ@100kHz φD: L: Lifetime @ Temp:2000hrs@105℃ Operating Temperature:-55℃~+105℃ Operating Temperature:-55℃~+105℃; LCSC Part Name: 100uF ±20% 50V; Supplier Part: C401753; Manufacturer: PANASONIC(松下); Supplier Footprint: SMD,D8xL10.2mm; JLCPCB Part Class: Extended Part; Datasheet: https://atta.szlcsc.com/upload/public/pdf/source/20190702/C401753_9556F7ED78DC20E0300381C2DC5AF272.pdf; Supplier: LCSC; Tolerance: ±20%; Ripple Current: 670mA@100kHz; Equivalent Series Resistance(ESR): 180mΩ@100kHz; Lifetime @ Temp: 2000hrs@105℃; Operating Temperature: -55℃~+105℃
R16 R17 R22 R23 R28 R29 R34 R35 R40 R41 R46 R47 = Res_1210: Supplier Footprint: 1210
U2 U25-U29 = TMC2226-SA-T: LCSC Part Name: 2A; Supplier Part: C705366; Manufacturer: TRINAMIC; Supplier Footprint: HTSSOP-28-EP-4.5mm; JLCPCB Part Class: Extended Part; Datasheet: https://atta.szlcsc.com/upload/public/pdf/source/20200720/C705366_FAB564586417FABF7E018B0AD29C9DC4.pdf; Supplier: LCSC
U7 = TUSB8041IPAPRQ1: Supplier Part: C2678037; Manufacturer: TI(德州仪器); Supplier Footprint: TQFP-64(10x10); JLCPCB Part Class: Extended Part; Datasheet: https://www.ti.com/cn/lit/gpn/tusb8041-q1; Supplier: LCSC
X1 = X322524MOB4SI: Crystal Type:Surface Mount Crystal Frequency: Normal temperature Frequency Tolerance:±10ppm Normal temperature Frequency Tolerance:±10ppm External load capacitor: Frequency Stability(Full temperature range):±20ppm Frequency Stability(Full temperature rang; LCSC Part Name: 24MHz ±10ppm 12pF; Supplier Part: C70590; Manufacturer: YXC(扬兴晶振); Supplier Footprint: SMD3225-4P; JLCPCB Part Class: Extended Part; Datasheet: https://atta.szlcsc.com/upload/public/pdf/source/20240329/19D5F850207469550BEB00D7DFEDBC7A.pdf; Supplier: LCSC; Crystal Type: Surface Mount Crystal; Normal temperature Frequency Tolerance: ±10ppm; Frequency Stability(Full temperature range): ±20ppm

## Nets
1V1: C70.1 C71.1 C78.1 C79.1 C80.1 C81.1 C82.1 C83.1 C84.1 U7.19(VDD) U7.25(VDD) U7.37(VDD) U7.45(VDD) U7.53(VDD) U7.60(VDD) U7.63(VDD) U15.1(OUT)
3V3: C9.1 C10.1 C11.1 C12.2 C19.1 C26.1 C33.1 C40.1 C47.1 C54.1 C68.1 C75.1 C76.1 C77.1 C87.2 C88.2 C89.2 C90.2 C91.2 C92.2 C93.2 C94.2 C95.2 C96.2 C97.2 C98.2 C99.2 C100.2 C105.1 C106.1 CN5.1 H3.1 H3.3 L1.2 R11.2 R15.1 R20.2 R26.2 R32.2 R38.2 R44.2 R50.2 R66.1 R67.2 RN2.5 RN2.6 U1.6(VBAT) U1.17(VDD) U1.30(VDD) U1.32(VREF+) U1.39(VDD) U1.52(VDD) U1.62(VDD) U1.72(VDD) U1.84(VDD) U1.95(VDD) U1.108(VDD) U1.121(VDD) U1.131(VDD) U1.143(PDR_ON) U1.144(VDD) U2.19(VCC_IO) U7.2(VDD33) U7.20(VDD33) U7.31(VDD33) U7.48(VDD33) U15.8(IN) U25.19(VCC_IO) U26.19(VCC_IO) U27.19(VCC_IO) U28.19(VCC_IO) U29.19(VCC_IO) U36.1 U37.2(Vdd) U38.2(Vdd) U39.5 U39.6 U39.7 U39.8 U40.1 U41.1
5V: C4.1 C5.1 C8.1 C13.1 CN4.1 CN4.3 D1.5(VBUS) D6.5(VBUS) D7.5(VBUS) H1.1 H2.1 R13.2 U13.4(IN) U17.1 U17.2 U52.1(DIR) U52.20(VCC) USB4.1(VCC) USB5.1(VCC) USB6.1(VCC)
12V: CN1.1 CN1.3 CN2.1 CN2.3 CN3.1 CN3.3 CN6.1 D8.1(K) D9.1(K) D10.1(K) D11.1(K) D12.1(K) H1.3 H2.3 U16.1 U16.2 U19.1 U20.1 U24.1
12V_LIGHT1: CN1.2 Q1.3(D)
12V_LIGHT2: CN1.4 Q2.3(D)
24V: C15.1 C16.1 C17.1 C18.1 C22.1 C23.1 C24.1 C25.1 C29.1 C30.1 C31.1 C32.1 C36.1 C37.1 C38.1 C39.1 C43.1 C44.1 C45.1 C46.1 C50.1 C51.1 C52.1 C53.1 C56.1 C57.1 C58.1 C59.1 C60.1 C61.1 C62.1 C63.1 C64.1 C65.1 C66.1 C67.1 U2.3(VS) U2.9(VCP) U2.26(VS) U6.9(VIN+) U6.10(VIN+) U12.7(VIN+) U12.8(VIN+) U18.1 U21.1 U25.3(VS) U25.9(VCP) U25.26(VS) U26.3(VS) U26.9(VCP) U26.26(VS) U27.3(VS) U27.9(VCP) U27.26(VS) U28.3(VS) U28.9(VCP) U28.26(VS) U29.3(VS) U29.9(VCP) U29.26(VS)
GND: C1.2 C2.2 C3.2 C4.2 C5.2 C8.2 C9.2 C10.2 C13.2 C68.2 C70.2 C71.2 C75.2 C76.2 C77.2 C78.2 C79.2 C80.2 C81.2 C82.2 C83.2 C84.2 C85.1 C86.1 C87.1 C88.1 C89.1 C90.1 C91.1 C92.1 C93.1 C94.1 C95.1 C96.1 C97.1 C98.1 C99.1 C100.1 C103.2 C104.2 C105.2 C106.2 C107.1 C108.1 C109.1 CN5.3 CN5.5 CN5.9 D1.2(GND) D5.3(GND) D6.2(GND) D7.2(GND) D13.3(GND) D14.3(GND) LED1.2(-) LED2.2(-) LED3.2(-) R2.1 R3.1 R4.1 R5.1 R9.2 R12.1 R75.1 R76.1 RN1.1 RN1.2 RN1.3 RN1.4 RN2.8 SW1.3(C) U1.16(VSS) U1.38(VSS) U1.51(VSS) U1.61(VSS) U1.83(VSS) U1.94(VSS) U1.107(VSS) U1.120(VSS) U1.130(VSS) U7.65(EP) U13.3(GND) U15.4(GND) U15.9(EP) U36.2 U37.8(GND) U38.8(GND) U40.2 U41.2 U52.10(GND) U52.19(OE#) USB4.4(GND) USB5.4(GND) USB6.4(GND) USB7.4(GND) USB7.7(GND_DRAIN) USB7.10(SHIELD) USB7.11(SHIELD)
GNDP: C15.2 C16.2 C17.2 C18.2 C19.2 C20.2 C22.2 C23.2 C24.2 C25.2 C26.2 C27.2 C29.2 C30.2 C31.2 C32.2 C33.2 C34.2 C36.2 C37.2 C38.2 C39.2 C40.2 C41.2 C43.2 C44.2 C45.2 C46.2 C47.2 C48.2 C50.2 C51.2 C52.2 C53.2 C54.2 C55.2 C56.2 C57.2 C58.2 C59.2 C60.2 C61.2 C62.2 C63.2 C64.2 C65.2 C66.2 C67.2 CN4.2 CN4.4 CN6.4 Q1.2(S) Q2.2(S) Q3.1(S) Q3.2(S) Q3.3(S) Q4.1(S) Q4.2(S) Q4.3(S) Q5.1(S) Q5.2(S) Q5.3(S) Q6.1(S) Q6.2(S) Q6.3(S) Q7.1(S) Q7.2(S) Q7.3(S) R16.2 R17.1 R18.2 R21.2 R22.2 R23.1 R24.2 R27.2 R28.2 R29.1 R30.2 R33.2 R34.2 R35.1 R36.2 R39.2 R40.2 R41.1 R42.2 R45.2 R46.2 R47.1 R48.2 R51.2 R52.1 R54.1 R56.1 R58.1 R60.1 R62.1 R64.1 RN1.5 RN1.6 RN1.7 RN1.8 U2.6(GND) U2.22(GND) U2.29(EP) U6.5(GND) U6.6(GND) U6.7(GND) U6.8(GND) U12.5(GND) U12.6(GND) U18.2 U19.2 U20.2 U21.2 U25.6(GND) U25.22(GND) U25.29(EP) U26.6(GND) U26.22(GND) U26.29(EP) U27.6(GND) U27.22(GND) U27.29(EP) U28.6(GND) U28.22(GND) U28.29(EP) U29.6(GND) U29.22(GND) U29.29(EP) U50.2 U51.2
VBUS: C3.1 R10.1 U1.101(PA9) USB7.1(VBUS)
_LED1_OUT: R53.2 U52.11(B7)
_LED2_OUT: R55.2 U52.12(B6)
_PUMP: R65.2 U52.13(B5)
_SOL1_BLOW: R59.2 U52.15(B3)
_SOL1_VAC: R57.2 U52.14(B4)
_SOL2_BLOW: R63.2 U52.17(B1)
_SOL2_VAC: R61.2 U52.16(B2)
BOOT0: H3.2 R76.2 U1.138(BOOT0)
BOOT1: H3.4 R75.2 U1.48(PB2)
D1+: U1.104(PA12) U7.56(USB_DP_DN4)
D1-: U1.103(PA11) U7.57(USB_DM_DN4)
D2+: D7.6(I/O1) U7.33(USB_DP_DN1)
D2-: D7.4(I/O2) U7.34(USB_DM_DN1)
D3+: D1.6(I/O1) U7.41(USB_DP_DN2)
D3-: D1.4(I/O2) U7.42(USB_DM_DN2)
D4+: D6.6(I/O1) U7.49(USB_DP_DN3)
D4-: D6.4(I/O2) U7.50(USB_DM_DN3)
DCAM1+: D6.1(I/O1) USB6.3(D+)
DCAM1-: D6.3(I/O2) USB6.2(D-)
DCAM2+: D1.1(I/O1) USB5.3(D+)
DCAM2-: D1.3(I/O2) USB5.2(D-)
DIAG1: LED3.1(+) R71.2 U1.68(PE15) U2.15(DIAG)
DIAG2: LED2.1(+) R72.2 U1.65(PE12) U25.15(DIAG)
DIAG3: U26.15(DIAG)
DIAG4: LED1.1(+) R73.2 U1.93(PG8) U27.15(DIAG)
DIAG5: U28.15(DIAG)
DIAG6: U29.15(DIAG)
DIR1: U1.11(PF1) U2.23(DIR)
DIR2: U1.59(PE8) U25.23(DIR)
DIR3: U1.28(PC2) U26.23(DIR)
DIR4: U1.34(PA0) U27.23(DIR)
DIR5: U1.58(PE7) U28.23(DIR)
DIR6: U1.124(PG9) U29.23(DIR)
DSUB+: D7.1(I/O1) USB4.3(D+)
DSUB-: D7.3(I/O2) USB4.2(D-)
EN1: R20.1 U1.12(PF2) U2.5(ENN)
EN2: R26.1 U1.123(PD7) U25.5(ENN)
EN3: R32.1 U1.26(PC0) U26.5(ENN)
EN4: R38.1 U1.29(PC3) U27.5(ENN)
EN5: R44.1 U1.37(PA3) U28.5(ENN)
EN6: R50.1 U1.10(PF0) U29.5(ENN)
IN_D+: D5.1(D+) U7.21(USB_DP_UP) USB7.3(D+)
IN_D-: D5.2(D-) U7.22(USB_DM_UP) USB7.2(D-)
LED1_OUT: U1.98(PC8) U52.9(A7)
LED2_OUT: U1.4(PE5) U52.8(A6)
MCU_RST: CN5.10 R67.1 RN2.4 SW1.1(A) U1.25(NRST)
MOT1_A1: U2.28(OA1) U30.3
MOT1_A2: U2.25(OA2) U30.4
MOT1_B1: U2.1(OB1) U30.2
MOT1_B2: U2.4(OB2) U30.1
MOT2_A1: U25.28(OA1) U31.3
MOT2_A2: U25.25(OA2) U31.4
MOT2_B1: U25.1(OB1) U31.2
MOT2_B2: U25.4(OB2) U31.1
MOT3_A1: U26.28(OA1) U32.3
MOT3_A2: U26.25(OA2) U32.4
MOT3_B1: U26.1(OB1) U32.2
MOT3_B2: U26.4(OB2) U32.1
MOT4_A1: U27.28(OA1) U33.3
MOT4_A2: U27.25(OA2) U33.4
MOT4_B1: U27.1(OB1) U33.2
MOT4_B2: U27.4(OB2) U33.1
MOT5_A1: U28.28(OA1) U34.3
MOT5_A2: U28.25(OA2) U34.4
MOT5_B1: U28.1(OB1) U34.2
MOT5_B2: U28.4(OB2) U34.1
MOT6_A1: U29.28(OA1) U35.3
MOT6_A2: U29.25(OA2) U35.4
MOT6_B1: U29.1(OB1) U35.2
MOT6_B2: U29.4(OB2) U35.1
OSC_IN: C103.1 R68.1 U1.23(PH0) X2.3(OSC2)
OSC_OUT: C104.1 R68.2 U1.24(PH1) X2.1(OSC1)
PUMP: U1.47(PB1) U52.7(A5)
PUMP_OUT: D12.2(A) Q7.5(D) Q7.6(D) Q7.7(D) Q7.8(D) U24.2
RX1: R19.1 U1.7(PC13) U2.18(PDN_UART)
RX2: R25.1 U1.2(PE3) U25.18(PDN_UART)
RX3: R31.1 U1.142(PE1) U26.18(PDN_UART)
RX4: R37.1 U1.118(PD4) U27.18(PDN_UART)
RX5: R43.1 U1.115(PD1) U28.18(PDN_UART)
RX6: R49.1 U1.122(PD6) U29.18(PDN_UART)
SCL1: U1.136(PB6) U37.7(SCL) U39.3
SCL2: U1.70(PB11) U38.7(SCL) U39.1
SDA1: U1.137(PB7) U37.6(SDA) U39.4
SDA2: U1.69(PB10) U38.6(SDA) U39.2
SDCLK: CN5.4 RN2.1 U1.109(PA14)
SDIO: CN5.2 RN2.3 U1.105(PA13)
SOL1_BLOW: U1.46(PB0) U52.5(A3)
SOL1_VAC: U1.85(PD14) U52.6(A4)
SOL2_BLOW: U1.80(PD11) U52.3(A1)
SOL2_VAC: U1.81(PD12) U52.4(A2)
SOLEN_1_OUT: CN2.2 D8.2(A) Q3.5(D) Q3.6(D) Q3.7(D) Q3.8(D)
SOLEN_2_OUT: CN2.4 D9.2(A) Q4.5(D) Q4.6(D) Q4.7(D) Q4.8(D)
SOLEN_3_OUT: CN3.2 D10.2(A) Q5.5(D) Q5.6(D) Q5.7(D) Q5.8(D)
SOLEN_4_OUT: CN3.4 D11.2(A) Q6.5(D) Q6.6(D) Q6.7(D) Q6.8(D)
SSRX+: D14.1(D+) U7.26(USB_SSRXP_UP) USB7.8(StdB_SSRX-)
SSRX-: D14.2(D-) U7.27(USB_SSRXM_UP) USB7.9(StdB_SSRX+)
SSTX+: D13.1(D+) U7.23(USB_SSTXP_UP) USB7.5(StdB_SSTX-)
SSTX-: D13.2(D-) U7.24(USB_SSTXM_UP) USB7.6(StdB_SSTX+)
STEP1: U1.60(PE9) U2.20(STEP)
STEP2: U1.64(PE11) U25.20(STEP)
STEP3: U1.66(PE13) U26.20(STEP)
STEP4: U1.67(PE14) U27.20(STEP)
STEP5: U1.86(PD15) U28.20(STEP)
STEP6: U1.82(PD13) U29.20(STEP)
SWO: CN5.6
TX1: R19.2 U1.3(PE4)
TX2: R25.2 U1.1(PE2)
TX3: R31.2 U1.141(PE0)
TX4: R37.2 U1.116(PD2)
TX5: R43.2 U1.114(PD0)
TX6: R49.2 U1.119(PD5)
$1N2007: C85.2 U1.71(VCAP_1)
$1N2033: C86.2 U1.106(VCAP_2)
$1N2499: C101.1 C102.2 U1.31(VSSA)
$1N2505: C101.2 C102.1 R66.2 U1.33(VDDA)
$2N527: U6.1(VOUT+) U6.2(VOUT+) U6.3(VOUT+) U6.4(VOUT+) U16.3 U16.4
$2N761: U12.1(VOUT+) U12.2(VOUT+) U12.3(VOUT+) U12.4(VOUT+) U17.3 U17.4
$2N1043: C11.2 R11.1 R12.2 U13.1(FB)
$2N1206: L1.1 U13.5(LX)
$2N1211: C12.1 U13.6(BS)
$2N1383: R13.1 U13.2(EN)
$2N1969: R15.2 U15.5(EN)
$3N416: C14.1 U2.7(CPO)
$3N422: C14.2 U2.8(CPI)
$3N500: R17.2 U2.2(BRB)
$3N504: R16.1 U2.27(BRA)
$3N752: R18.1 U2.17(CLK)
$3N1117: R21.1 U2.24(STDBY)
$3N6545: C20.1 U2.11(5VOUT)
$3N7297: R24.1 U25.17(CLK)
$3N7298: R27.1 U25.24(STDBY)
$3N7300: R22.1 U25.27(BRA)
$3N7313: C21.1 U25.7(CPO)
$3N7314: C21.2 U25.8(CPI)
$3N7317: R23.2 U25.2(BRB)
$3N7318: C27.1 U25.11(5VOUT)
$3N8087: R30.1 U26.17(CLK)
$3N8088: R33.1 U26.24(STDBY)
$3N8090: R28.1 U26.27(BRA)
$3N8103: C28.1 U26.7(CPO)
$3N8104: C28.2 U26.8(CPI)
$3N8107: R29.2 U26.2(BRB)
$3N8108: C34.1 U26.11(5VOUT)
$3N8877: R36.1 U27.17(CLK)
$3N8878: R39.1 U27.24(STDBY)
$3N8880: R34.1 U27.27(BRA)
$3N8893: C35.1 U27.7(CPO)
$3N8894: C35.2 U27.8(CPI)
$3N8897: R35.2 U27.2(BRB)
$3N8898: C41.1 U27.11(5VOUT)
$3N9667: R42.1 U28.17(CLK)
$3N9668: R45.1 U28.24(STDBY)
$3N9670: R40.1 U28.27(BRA)
$3N9683: C42.1 U28.7(CPO)
$3N9684: C42.2 U28.8(CPI)
$3N9687: R41.2 U28.2(BRB)
$3N9688: C48.1 U28.11(5VOUT)
$3N10457: R48.1 U29.17(CLK)
$3N10458: R51.1 U29.24(STDBY)
$3N10460: R46.1 U29.27(BRA)
$3N10473: C49.1 U29.7(CPO)
$3N10474: C49.2 U29.8(CPI)
$3N10477: R47.2 U29.2(BRB)
$3N10478: C55.1 U29.11(5VOUT)
$4N704: Q1.1(G) R52.2 R53.1
$4N921: Q2.1(G) R54.2 R55.1
$4N1250: Q3.4(G) R56.2 R57.1
$4N1486: Q4.4(G) R58.2 R59.1
$4N1876: Q6.4(G) R62.2 R63.1
$4N1898: Q5.4(G) R60.2 R61.1
$4N2110: Q7.4(G) R64.2 R65.1
$5N12575: C107.2 R71.1 U36.3
$5N12832: C108.2 R72.1 U40.3
$5N12964: C109.2 R73.1 U41.3
$5N15082: H1.2 U50.1
$5N15193: H2.2 U51.1
$6N727: C2.1 R1.2 U7.29(XO) X1.3(OSC2)
$6N739: C1.1 R1.1 U7.30(XI) X1.1(OSC1)
$6N1394: R3.2 U7.1(PWRCTL3/BATEN3)
$6N1398: R2.2 U7.3(PWRCTL2/BATEN2)
$6N1403: R4.2 U7.4(PWRCTL1/BATEN1)
$6N1474: R5.2 U7.64(PWRCTL4/BATEN4)
$6N1833: R9.1 R10.2 U7.16(USB_VBUS)

Not connected (* = marked no-connect by the designer): CN5 7* 8*; CN6 2* 3*; RN2 2* 7*; SW1 2(B)* 4(D)*; U1 5(PE6)* 8(PC14)* 9(PC15)* 13(PF3)* 14(PF4)* 15(PF5)* 18(PF6)* 19(PF7)* 20(PF8)* 21(PF9)* 22(PF10)* 27(PC1)* 35(PA1)* 36(PA2)* 40(PA4)* 41(PA5)* 42(PA6)* 43(PA7)* 44(PC4)* 45(PC5)* 49(PF11)* 50(PF12)* 53(PF13)* 54(PF14)* 55(PF15)* 56(PG0)* 57(PG1)* 63(PE10)* 73(PB12)* 74(PB13)* 75(PB14)* 76(PB15)* 77(PD8)* 78(PD9)* 79(PD10)* 87(PG2)* 88(PG3)* 89(PG4)* 90(PG5)* 91(PG6)* 92(PG7)* 96(PC6)* 97(PC7)* 99(PC9)* 100(PA8)* 102(PA10)* 110(PA15)* 111(PC10)* 112(PC11)* 113(PC12)* 117(PD3)* 125(PG10)* 126(PG11)* 127(PG12)* 128(PG13)* 129(PG14)* 132(PG15)* 133(PB3)* 134(PB4)* 135(PB5)* 139(PB8)* 140(PB9)*; U2 10(SPREAD)* 12(MS1_AD0)* 13(NC)* 14(MS2_AD1)* 16(INDEX)* 21(VREF)*; U6 11(NC)* 12(TRIM)* 13(RC)*; U7 5(SDA/SMBDAT)* 6(SCL/SMBCLK)* 7(SMBUSz/SS_SUSPEND)* 8(FULLPWRMGMTz/SMBA1/SS_UP)* 9(PWRCTL_POL)* 10(GANGED/SMBAS2/HS_UP)* 11(OVERCUR4z)* 12(OVERCUR3z)* 13(AUTOENz/HS_SUSPEND)* 14(OVERCUR1z)* 15(OVERCUR2z)* 17(TEST)* 18(GRSTz)* 28(NC)* 32(USB_R1)* 35(USB_SSTXP_DN1)* 36(USB_SSTXM_DN1)* 38(USB_SSRXP_DN1)* 39(USB_SSRXM_DN1)* 40(NC)* 43(USB_SSTXP_DN2)* 44(USB_SSTXM_DN2)* 46(USB_SSRXP_DN2)* 47(USB_SSRXM_DN2)* 51(USB_SSTXP_DN3)* 52(USB_SSTXM_DN3)* 54(USB_SSRXP_DN3)* 55(USB_SSRXM_DN3)* 58(USB_SSTXP_DN4)* 59(USB_SSTXM_DN4)* 61(USB_SSRXP_DN4)* 62(USB_SSRXM_DN4)*; U12 9(NC)* 10(TRIM)* 11(RC)*; U15 2(NC)* 3(NC/FB)* 6(PG)* 7(NC)*; U25 10(SPREAD)* 12(MS1_AD0)* 13(NC)* 14(MS2_AD1)* 16(INDEX)* 21(VREF)*; U26 10(SPREAD)* 12(MS1_AD0)* 13(NC)* 14(MS2_AD1)* 16(INDEX)* 21(VREF)*; U27 10(SPREAD)* 12(MS1_AD0)* 13(NC)* 14(MS2_AD1)* 16(INDEX)* 21(VREF)*; U28 10(SPREAD)* 12(MS1_AD0)* 13(NC)* 14(MS2_AD1)* 16(INDEX)* 21(VREF)*; U29 10(SPREAD)* 12(MS1_AD0)* 13(NC)* 14(MS2_AD1)* 16(INDEX)* 21(VREF)*; U37 1(N/C)* 3(N/C)* 4(N/C)* 5(N/C)*; U38 1(N/C)* 3(N/C)* 4(N/C)* 5(N/C)*; U52 2(A0)* 18(B0)*; USB4 SH1 SH2; USB5 SH1 SH2; USB6 SH1 SH2; X1 2(GND)* 4(GND)*; X2 2(GND)* 4(GND)*

## Notes on the sheets
sheet 3
- 1x axis X
  1x axis Y1
  1x axis Y2
  1x axis Z
  1x axis Rot1
  1x axis Rot2
